# EAGLE design FMC_prototype (EAGLE 6.5.0)
DESIGNER: OPEN EPHYS; DESIGN_NAME: FMC ACQUISITION ADAPTER; REVISION: 0.1
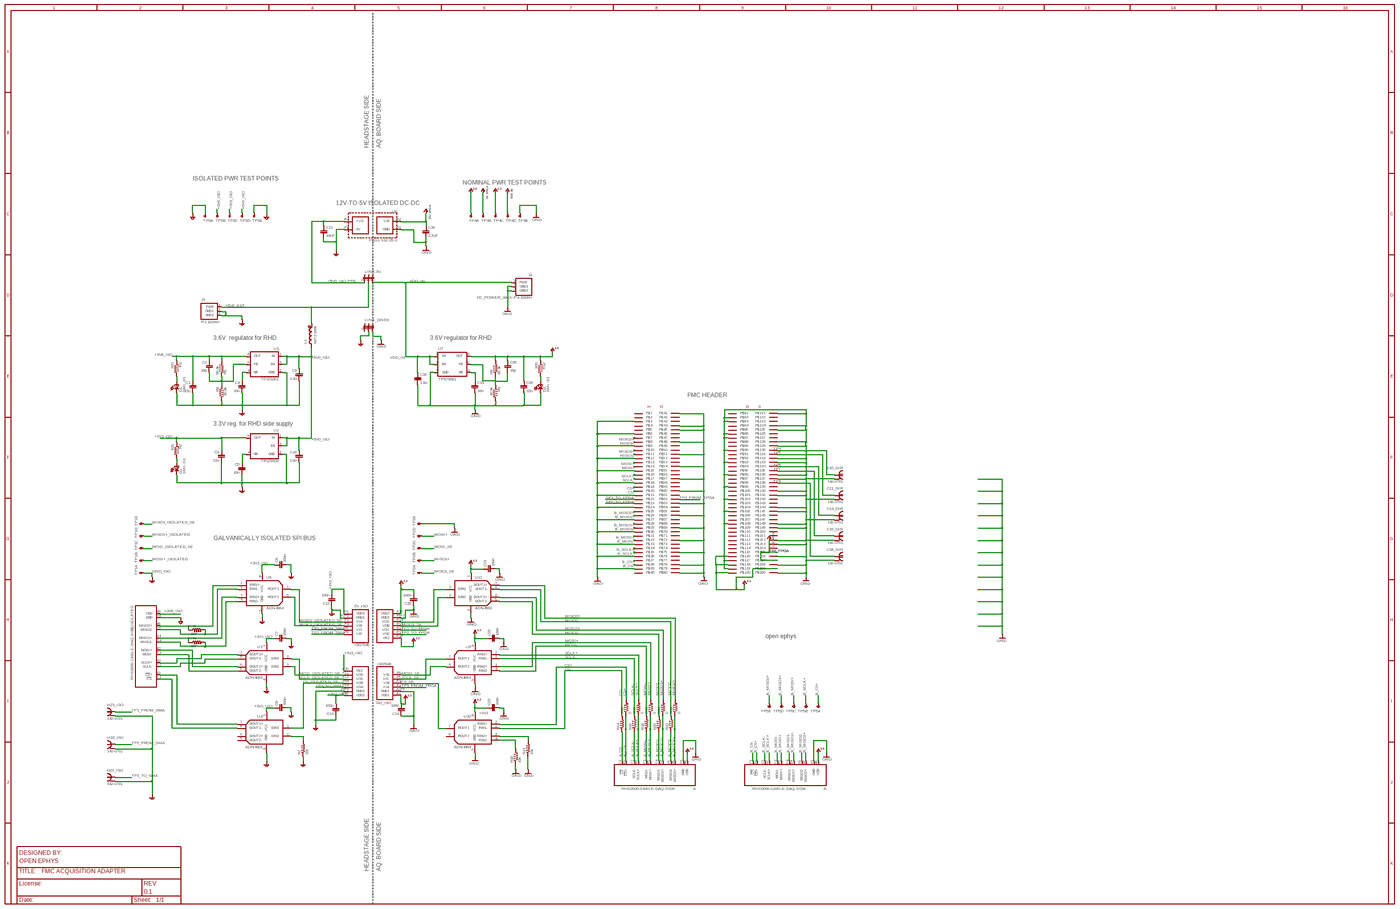
[diagram p0: schematic, sheet 1, overview]
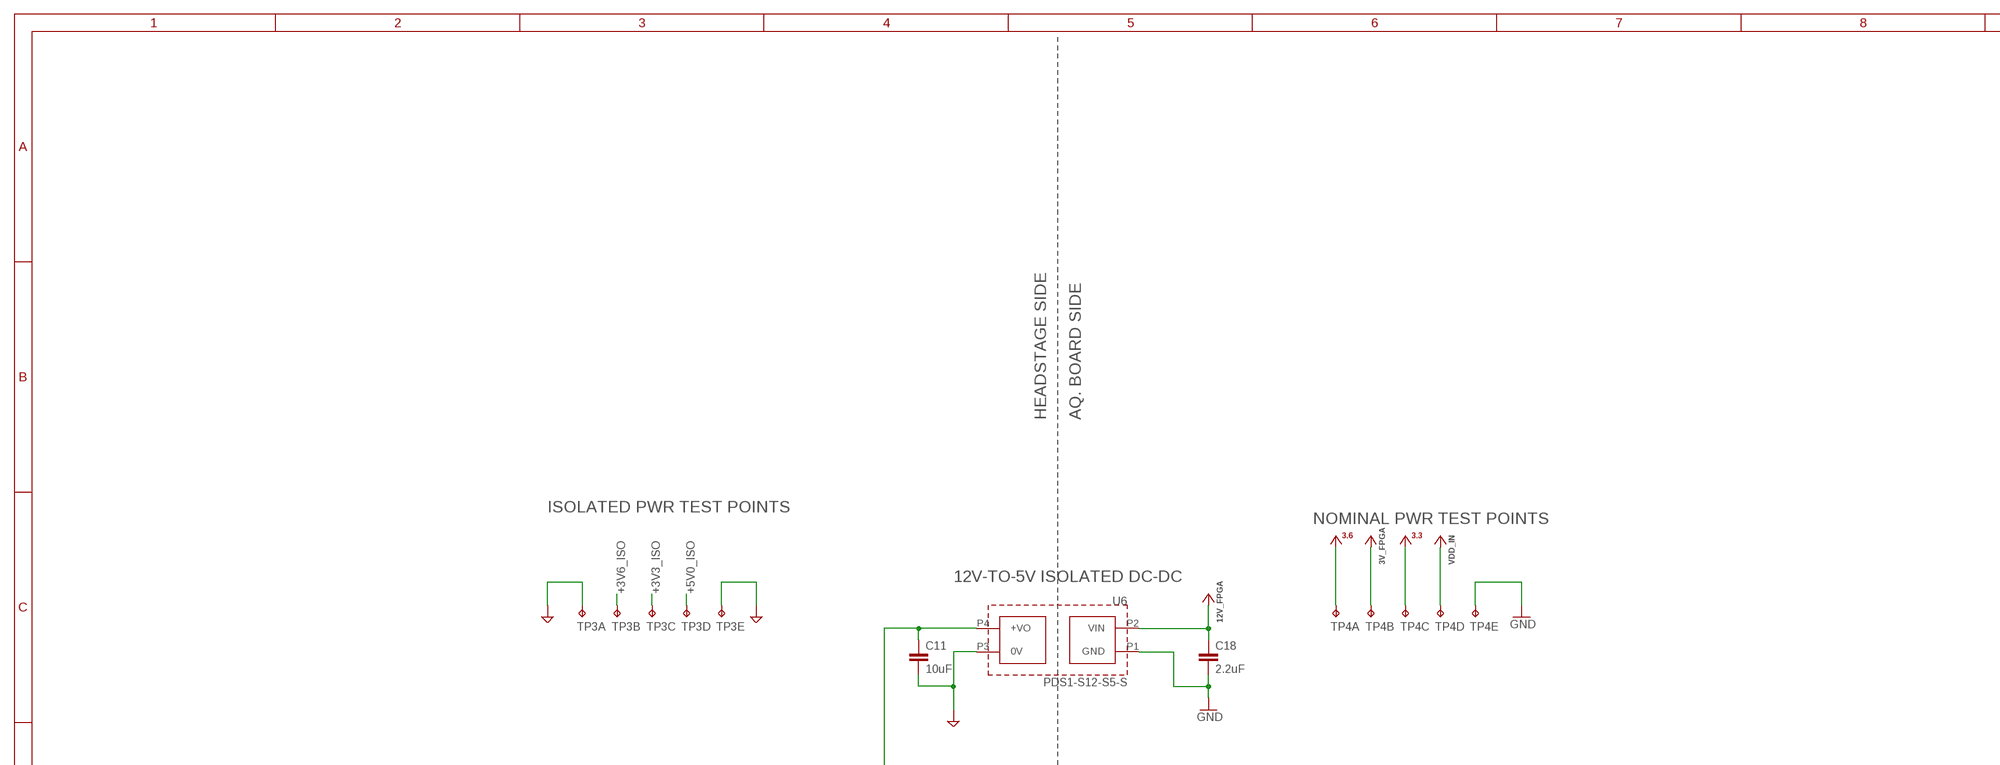
[diagram p1: schematic, sheet 1, part 1 of 4]
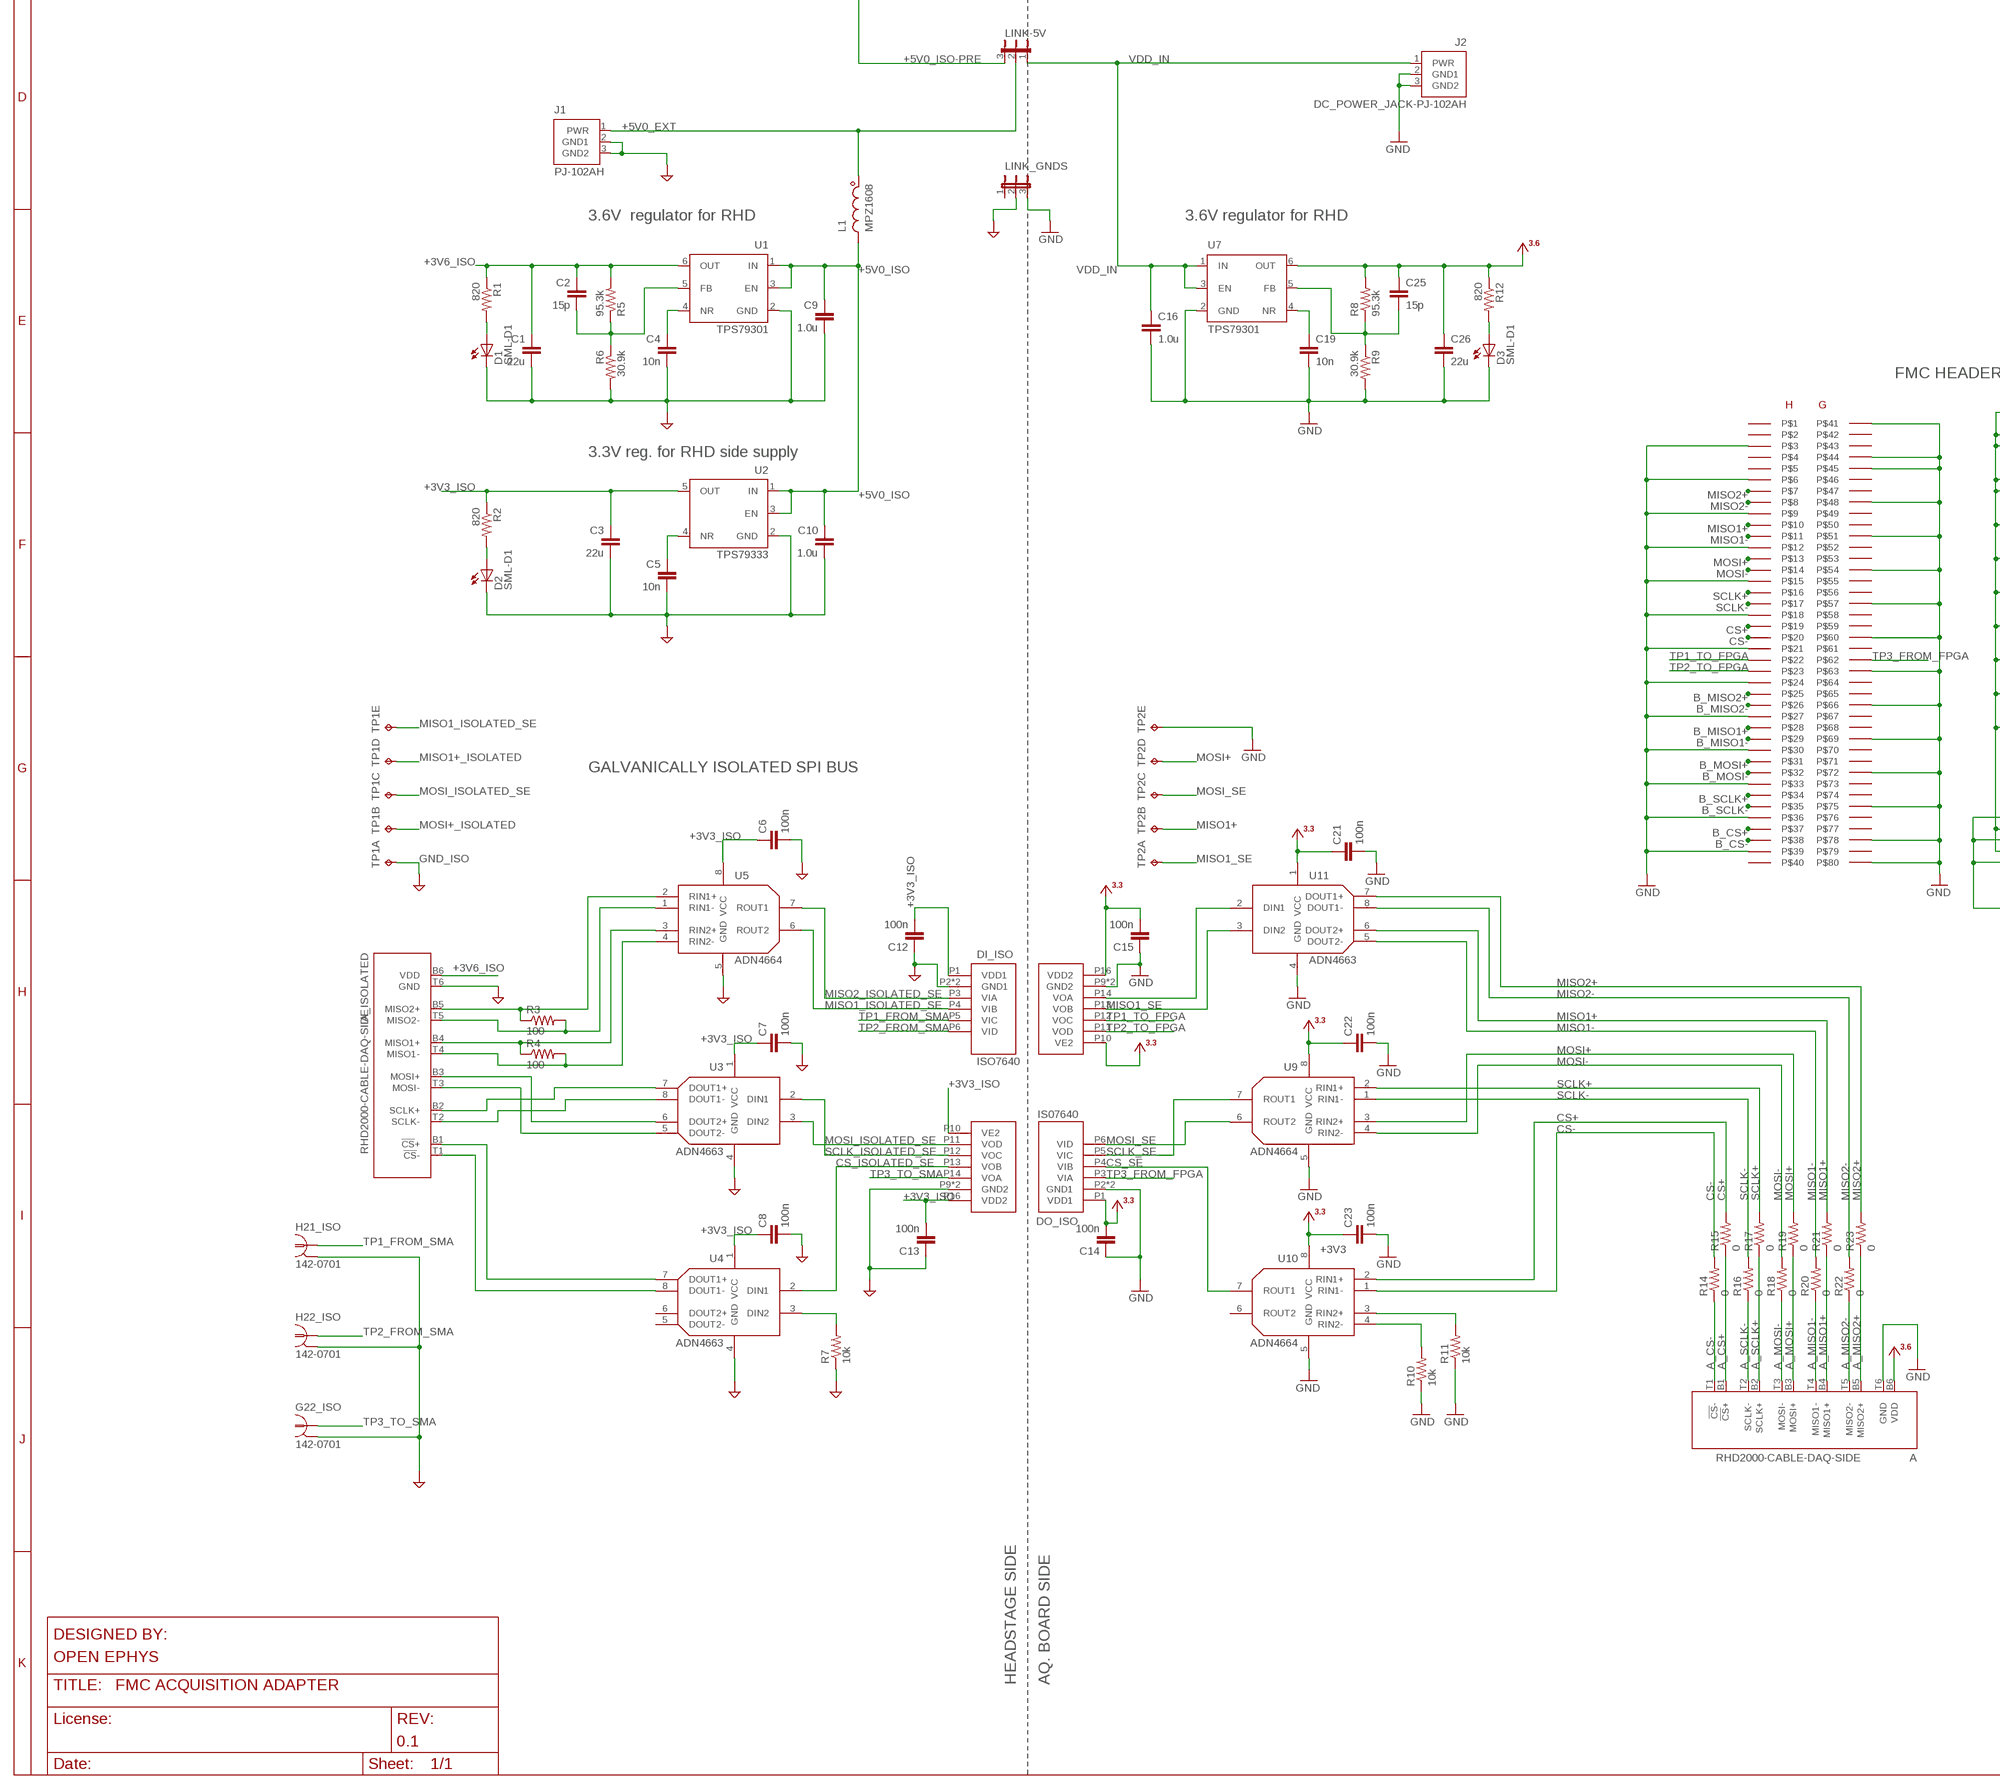
[diagram p2: schematic, sheet 1, part 2 of 4]
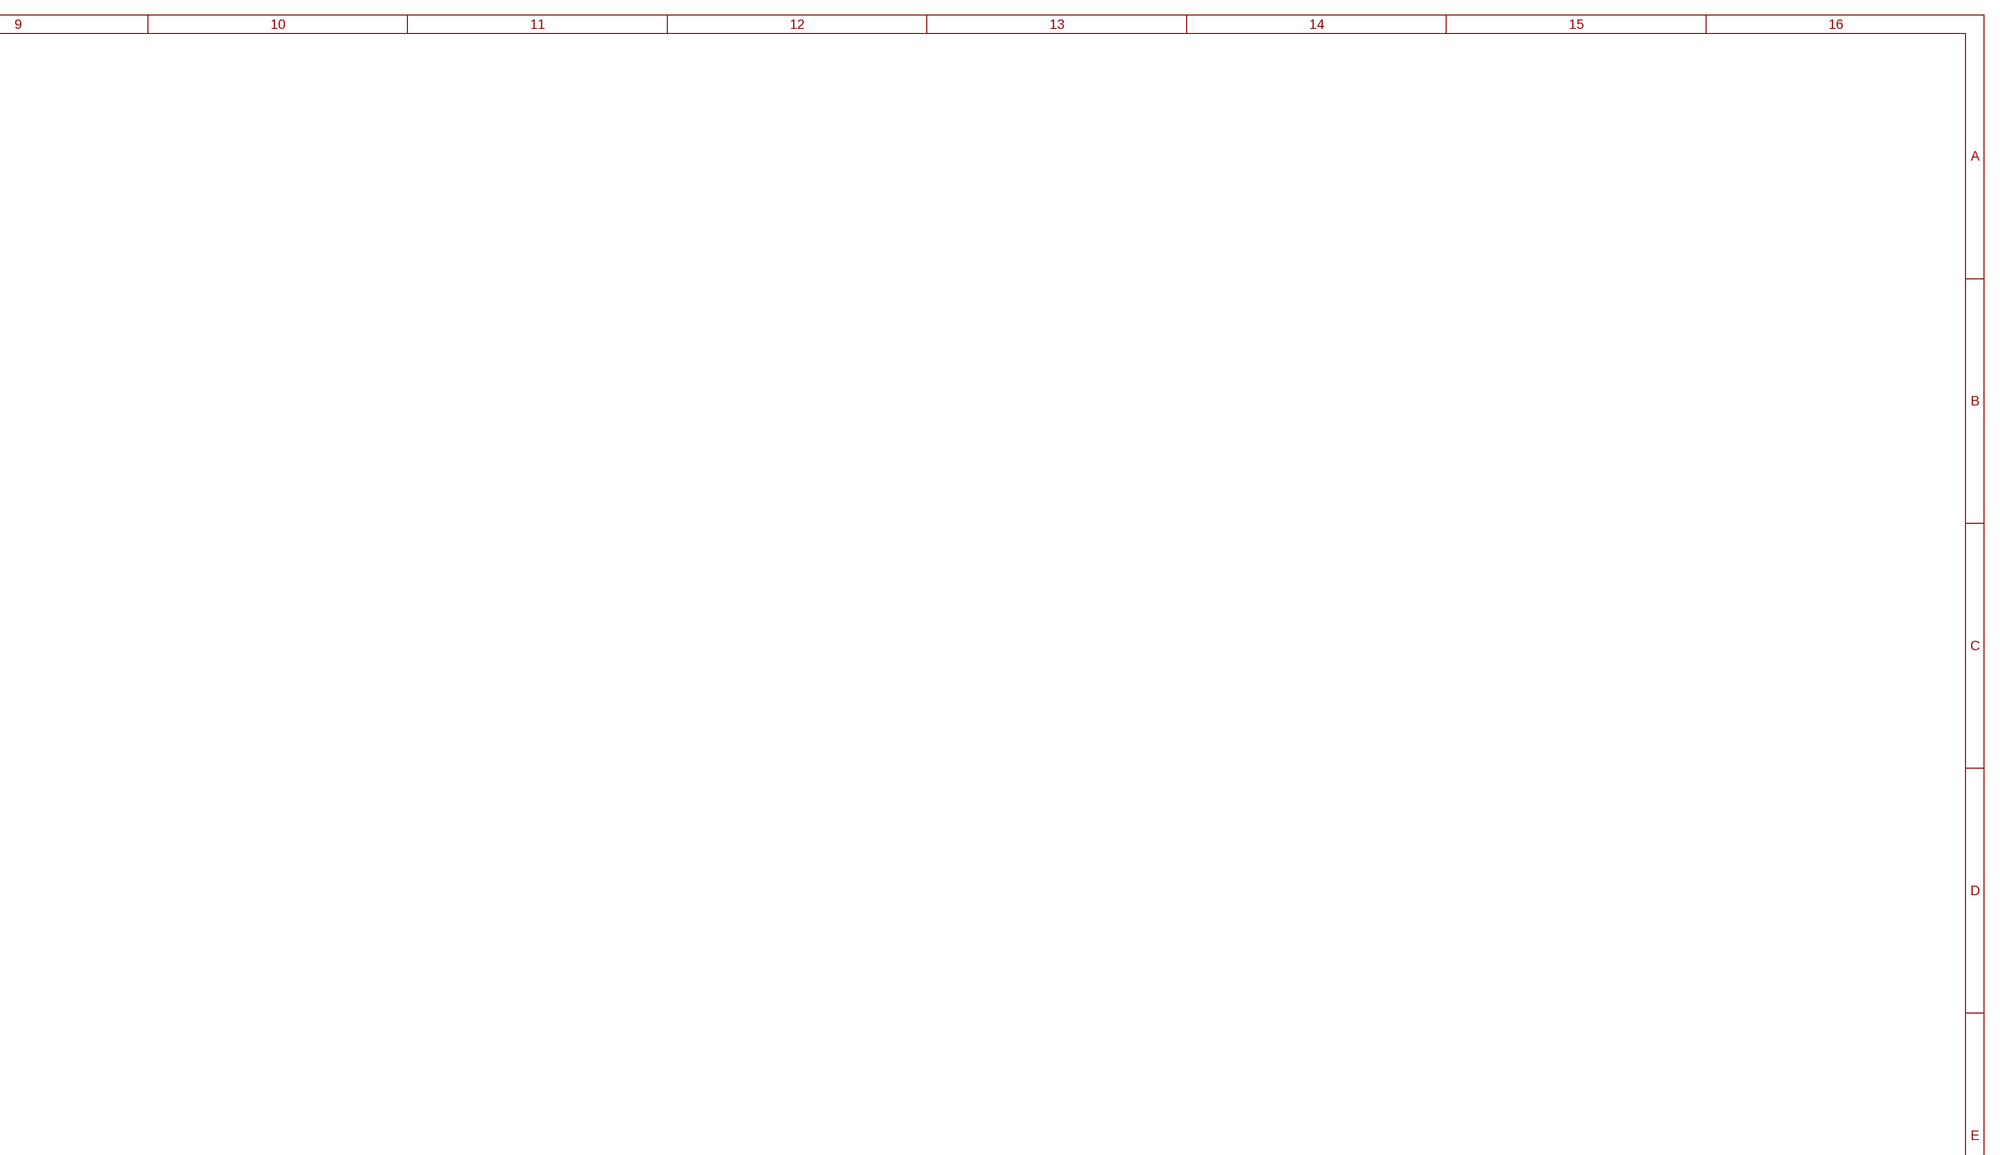
[diagram p3: schematic, sheet 1, part 3 of 4]
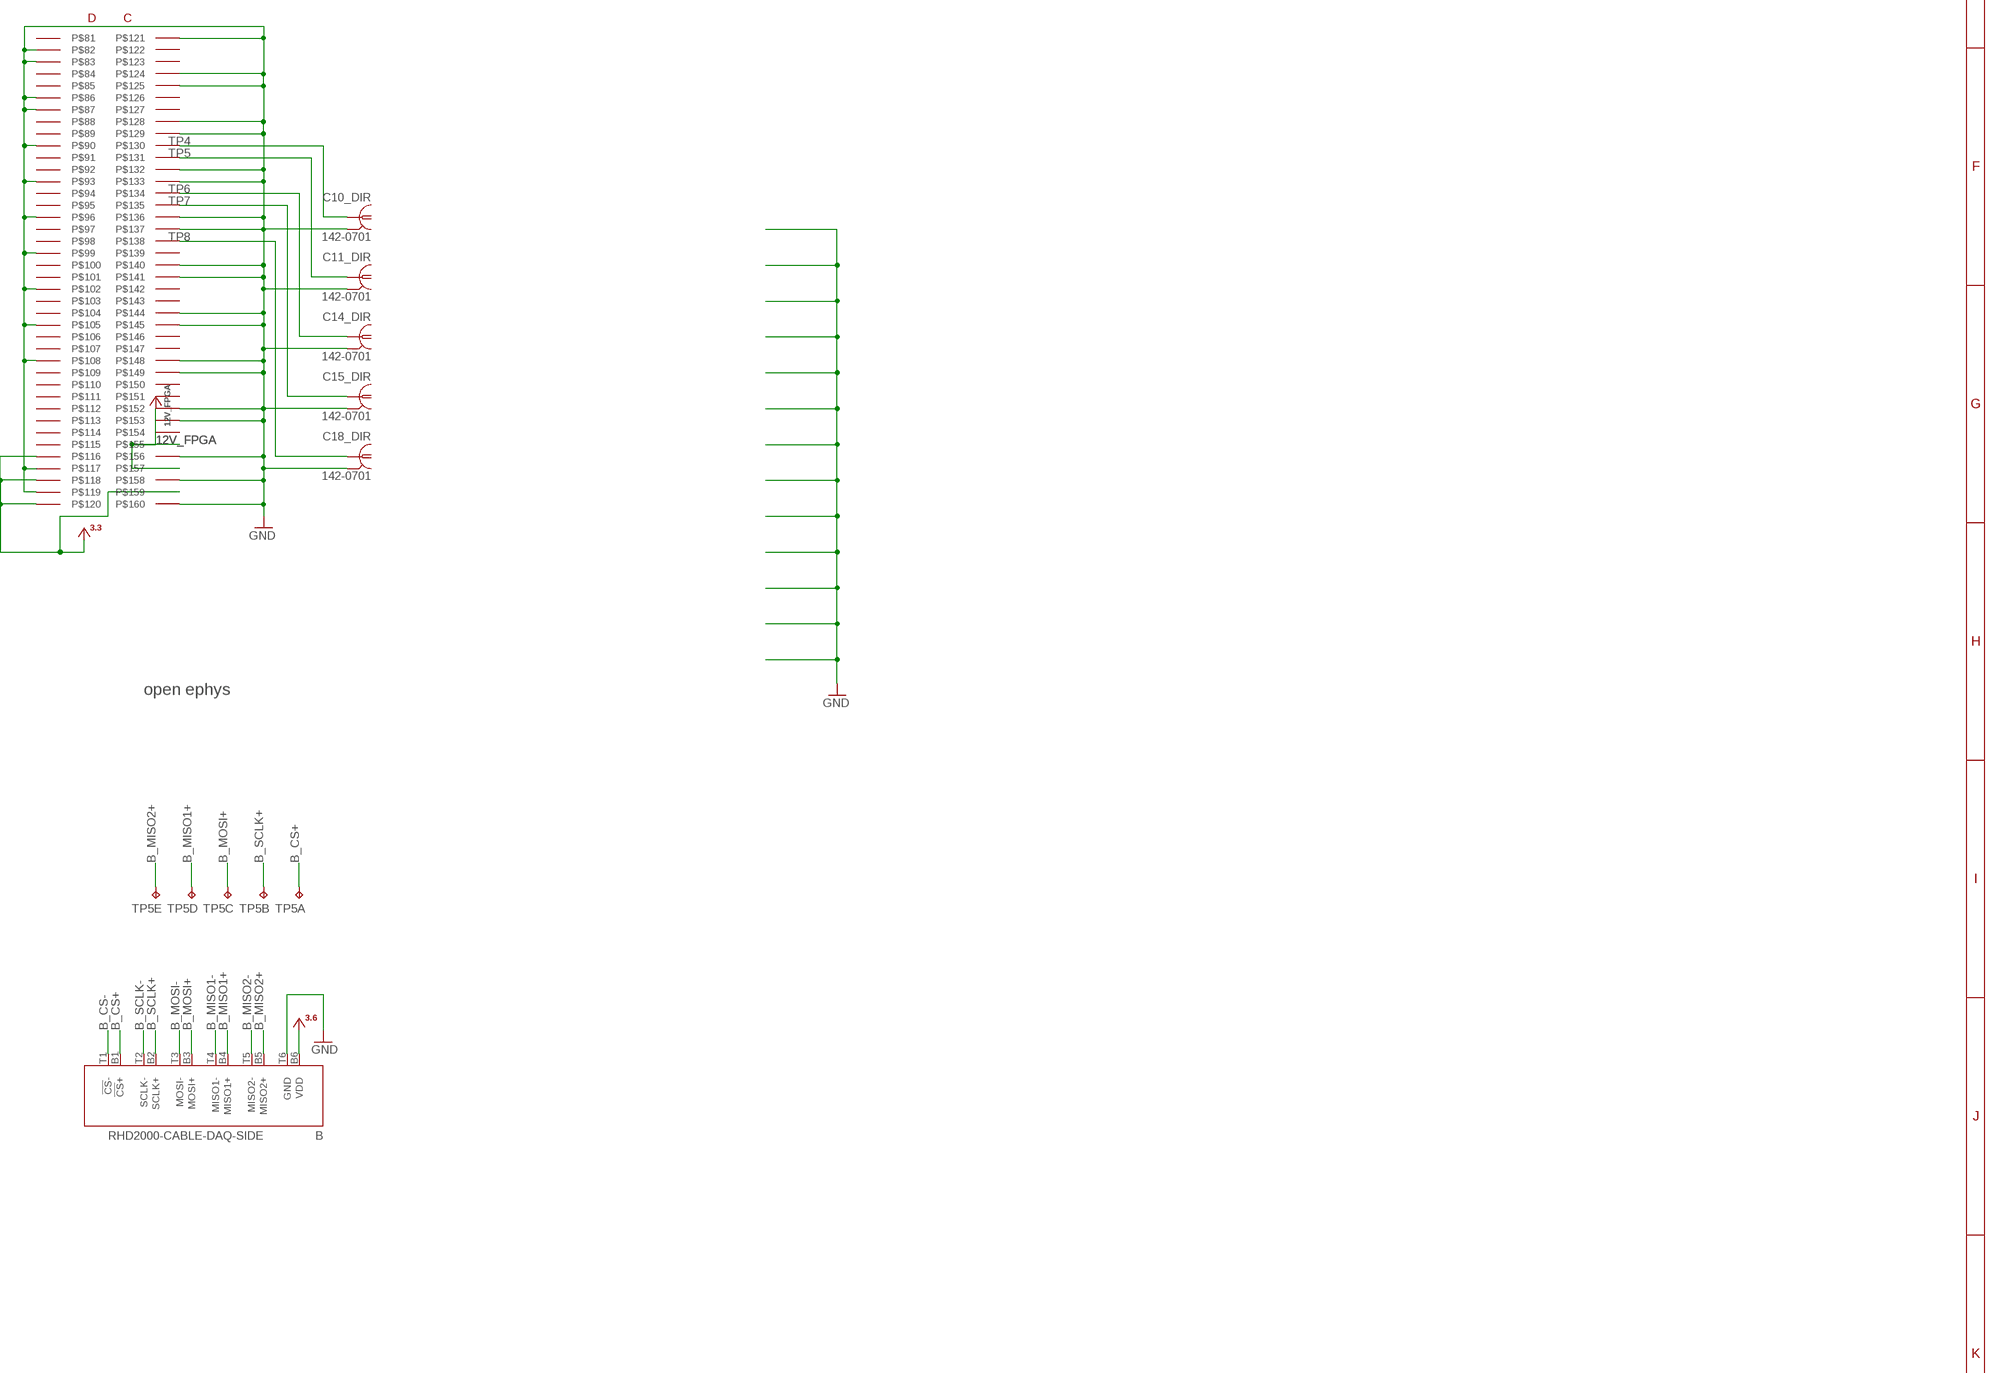
[diagram p4: schematic, sheet 1, part 4 of 4]

## Parts
A  RHD2000-CABLE-DAQ-SIDE  [OMNETICS_PZN-12-AA]
A_ISOLATED  RHD2000-CABLE-DAQ-SIDE  [OMNETICS_PZN-12-AA]
B  RHD2000-CABLE-DAQ-SIDE  [OMNETICS_PZN-12-AA]
C1  22u  C_1206  [1206]
C2  15p  C_0603  [0603]
C3  22u  C_1206  [1206]
C4  10n  C_0603  [0603]
C5  10n  C_0603  [0603]
C6  100n  C_0603  [0603]
C7  100n  C_0603  [0603]
C8  100n  C_0603  [0603]
C9  1.0u  C_0805  [0805]
C10  1.0u  C_0805  [0805]
C10_DIR  142-0701  COAX_SMA-VERT  [SMA_JACK_142-0701-201]
C11  10uF  C_1206  [1206]
C11_DIR  142-0701  COAX_SMA-VERT  [SMA_JACK_142-0701-201]
C12  100n  C_0603  [0603]
C13  100n  C_0603  [0603]
C14  100n  C_0603  [0603]
C14_DIR  142-0701  COAX_SMA-VERT  [SMA_JACK_142-0701-201]
C15  100n  C_0603  [0603]
C15_DIR  142-0701  COAX_SMA-VERT  [SMA_JACK_142-0701-201]
C16  1.0u  C_0805  [0805]
C18  2.2uF  C_1206  [1206]
C18_DIR  142-0701  COAX_SMA-VERT  [SMA_JACK_142-0701-201]
C19  10n  C_0603  [0603]
C21  100n  C_0603  [0603]
C22  100n  C_0603  [0603]
C23  100n  C_0603  [0603]
C25  15p  C_0603  [0603]
C26  22u  C_1206  [1206]
D1  SML-D1  LED_0603  [LED-0603]
D2  SML-D1  LED_0603  [LED-0603]
D3  SML-D1  LED_0603  [LED-0603]
DI_ISO  ISO7640  ADUM3440  [SOIC_WIDE_16]
DO_ISO  IS07640  ADUM3440  [SOIC_WIDE_16]
FMC  FMC_LPC_160_PIN  [FMC_LPC_MALE_WITH_SP601_BSILK]
G22_ISO  142-0701  COAX_SMA-VERT  [SMA_JACK_142-0701-201]
H21_ISO  142-0701  COAX_SMA-VERT  [SMA_JACK_142-0701-201]
H22_ISO  142-0701  COAX_SMA-VERT  [SMA_JACK_142-0701-201]
J1  PJ-102AH  DC_POWER_JACK-PJ-102AH  [PJ-102AH]
J2  DC_POWER_JACK-PJ-102AH  [PJ-102AH]
L1  MPZ1608  L_0603  [0603]
LINK-5V  JP2E  [JP2]
LINK_GNDS  JP2E  [JP2]
R1  820  R_0603  [0603]
R2  820  R_0603  [0603]
R3  100  R_0603  [0603]
R4  100  R_0603  [0603]
R5  95.3k  R_0603  [0603]
R6  30.9k  R_0603  [0603]
R7  10k  R_0603  [0603]
R8  95.3k  R_0603  [0603]
R9  30.9k  R_0603  [0603]
R10  10k  R_0603  [0603]
R11  10k  R_0603  [0603]
R12  820  R_0603  [0603]
R14  0  R_0603  [0603]
R15  0  R_0603  [0603]
R16  0  R_0603  [0603]
R17  0  R_0603  [0603]
R18  0  R_0603  [0603]
R19  0  R_0603  [0603]
R20  0  R_0603  [0603]
R21  0  R_0603  [0603]
R22  0  R_0603  [0603]
R23  0  R_0603  [0603]
TP1  TP5P5-25-13  [P5-25-13]
TP2  TP5P5-25-13  [P5-25-13]
TP3  TP5P5-25-13  [P5-25-13]
TP4  TP5P5-25-13  [P5-25-13]
TP5  TP5P5-25-13  [P5-25-13]
U1  TPS79301  [SOT-23-6]
U2  TPS79333  [SOT-23-5]
U3  ADN4663  ADN4663_SOIC  [SOIC127P500X400-8N]
U4  ADN4663  ADN4663_SOIC  [SOIC127P500X400-8N]
U5  ADN4664  ADN4664_SOIC  [SOIC127P500X400-8N]
U6  PDS1-S12-S5-S  PDS1  [PDS1]
U7  TPS79301  [SOT-23-6]
U9  ADN4664  ADN4664_SOIC  [SOIC127P500X400-8N]
U10  ADN4664  ADN4664_SOIC  [SOIC127P500X400-8N]
U11  ADN4663  ADN4663_SOIC  [SOIC127P500X400-8N]
U$1  OPEN_EPHYS_LOGO  [OPEN_EPHYS_LOGO]

## Nets
12V_FPGA: C18.1 FMC.P$155 FMC.P$157 U6.P2(VIN)
+3V3: C14.2 C15.2 C21.1 C22.1 C23.1 DI_ISO.P10(VE2) DI_ISO.P16(VDD2) DO_ISO.P1(VDD1) FMC.P$116 FMC.P$118 FMC.P$120 FMC.P$159 TP4.TP-2 TP4.TP-3 U9.8(VCC) U10.8(VCC) U11.1(VCC)
+3V3_ISO: C3.1 C6.1 C7.1 C8.1 C12.2 C13.2 DI_ISO.P1(VDD1) DO_ISO.P10(VE2) DO_ISO.P16(VDD2) R2.1 TP3.TP-3 U2.5(OUT) U3.1(VCC) U4.1(VCC) U5.8(VCC)
+3V6: A.B6(VDD) B.B6(VDD) C25.1 C26.1 R8.2 R12.1 TP4.TP-1 U7.6(OUT)
+3V6_ISO: A_ISOLATED.B6(VDD) C1.1 C2.1 R1.1 R5.2 TP3.TP-2 U1.6(OUT)
+5V0_EXT: J1.1(PWR) L1.1 LINK-5V.2
+5V0_ISO: C9.1 C10.1 L1.2 TP3.TP-4 U1.1(IN) U1.3(EN) U2.1(IN) U2.3(EN)
+5V0_ISO-PRE: C11.1 LINK-5V.3 U6.P4(+VO)
A_CS+: A.B1(!CS!+) R15.1
A_CS-: A.T1(!CS!-) R14.1
A_MISO1+: A.B4(MISO1+) R21.1
A_MISO1-: A.T4(MISO1-) R20.1
A_MISO2+: A.B5(MISO2+) R23.1
A_MISO2-: A.T5(MISO2-) R22.1
A_MOSI+: A.B3(MOSI+) R19.1
A_MOSI-: A.T3(MOSI-) R18.1
A_SCLK+: A.B2(SCLK+) R17.1
A_SCLK-: A.T2(SCLK-) R16.1
B_CS+: B.B1(!CS!+) FMC.P$37 TP5.TP-1
B_CS-: B.T1(!CS!-) FMC.P$38
B_MISO1+: B.B4(MISO1+) FMC.P$28 TP5.TP-4
B_MISO1-: B.T4(MISO1-) FMC.P$29
B_MISO2+: B.B5(MISO2+) FMC.P$25 TP5.TP-5
B_MISO2-: B.T5(MISO2-) FMC.P$26
B_MOSI+: B.B3(MOSI+) FMC.P$31 TP5.TP-3
B_MOSI-: B.T3(MOSI-) FMC.P$32
B_SCLK+: B.B2(SCLK+) FMC.P$34 TP5.TP-2
B_SCLK-: B.T2(SCLK-) FMC.P$35
CS+: FMC.P$19 R15.2 U10.2(RIN1+)
CS+_ISOLATED: A_ISOLATED.B1(!CS!+) U4.7(DOUT1+)
CS-: FMC.P$20 R14.2 U10.1(RIN1-)
CS-_ISOLATED: A_ISOLATED.T1(!CS!-) U4.8(DOUT1-)
CS_ISOLATED_SE: DO_ISO.P13(VOB) U4.2(DIN1)
CS_SE: DO_ISO.P4(VIB) U10.7(ROUT1)
GND: A.T6(GND) B.T6(GND) C10_DIR.GND$1 C10_DIR.GND$2 C10_DIR.GND$3 C10_DIR.GND$4 C11_DIR.GND$1 C11_DIR.GND$2 C11_DIR.GND$3 C11_DIR.GND$4 C14.1 C14_DIR.GND$1 C14_DIR.GND$2 C14_DIR.GND$3 C14_DIR.GND$4 C15.1 C15_DIR.GND$1 C15_DIR.GND$2 C15_DIR.GND$3 C15_DIR.GND$4 C16.2 C18.2 C18_DIR.GND$1 C18_DIR.GND$2 C18_DIR.GND$3 C18_DIR.GND$4 C19.2 C21.2 C22.2 C23.2 C26.2 D3.C DI_ISO.P9(GND2) DI_ISO.P15(GND2) DO_ISO.P2(GND1) DO_ISO.P8(GND1) FMC.P$3 FMC.P$6 FMC.P$9 FMC.P$12 FMC.P$15 FMC.P$18 FMC.P$21 FMC.P$24 FMC.P$27 FMC.P$30 FMC.P$33 FMC.P$36 FMC.P$39 FMC.P$41 FMC.P$44 FMC.P$45 FMC.P$48 FMC.P$51 FMC.P$54 FMC.P$57 FMC.P$60 FMC.P$63 FMC.P$66 FMC.P$69 FMC.P$72 FMC.P$75 FMC.P$78 FMC.P$80 FMC.P$82 FMC.P$83 FMC.P$86 FMC.P$87 FMC.P$90 FMC.P$93 FMC.P$96 FMC.P$99 FMC.P$102 FMC.P$105 FMC.P$108 FMC.P$117 FMC.P$119 FMC.P$121 FMC.P$124 FMC.P$125 FMC.P$128 FMC.P$129 FMC.P$132 FMC.P$133 FMC.P$136 FMC.P$137 FMC.P$140 FMC.P$141 FMC.P$144 FMC.P$145 FMC.P$148 FMC.P$149 FMC.P$152 FMC.P$153 FMC.P$156 FMC.P$158 FMC.P$160 J2.2(GND1) J2.3(GND2) LINK_GNDS.3 R9.2 R10.1 R11.1 TP2.TP-5 TP4.TP-5 U6.P1(GND) U7.2(GND) U9.5(GND) U10.5(GND) U11.4(GND)
GND_ISO: A_ISOLATED.T6(GND) C1.2 C3.2 C4.2 C5.2 C6.2 C7.2 C8.2 C9.2 C10.2 C11.2 C12.1 C13.1 D1.C D2.C DI_ISO.P2(GND1) DI_ISO.P8(GND1) DO_ISO.P9(GND2) DO_ISO.P15(GND2) G22_ISO.GND$1 G22_ISO.GND$2 G22_ISO.GND$3 G22_ISO.GND$4 H21_ISO.GND$1 H21_ISO.GND$2 H21_ISO.GND$3 H21_ISO.GND$4 H22_ISO.GND$1 H22_ISO.GND$2 H22_ISO.GND$3 H22_ISO.GND$4 J1.2(GND1) J1.3(GND2) LINK_GNDS.2 R6.2 R7.1 TP1.TP-1 TP3.TP-1 TP3.TP-5 U1.2(GND) U2.2(GND) U3.4(GND) U4.4(GND) U5.5(GND) U6.P3(0V)
MISO1+: FMC.P$10 R21.2 TP2.TP-2 U11.6(DOUT2+)
MISO1+_ISOLATED: A_ISOLATED.B4(MISO1+) R4.1 TP1.TP-4 U5.3(RIN2+)
MISO1-: FMC.P$11 R20.2 U11.5(DOUT2-)
MISO1-_ISOLATED: A_ISOLATED.T4(MISO1-) R4.2 U5.4(RIN2-)
MISO1_ISOLATED_SE: DI_ISO.P4(VIB) TP1.TP-5 U5.6(ROUT2)
MISO1_SE: DI_ISO.P13(VOB) TP2.TP-1 U11.3(DIN2)
MISO2+: FMC.P$7 R23.2 U11.7(DOUT1+)
MISO2+_ISOLATED: A_ISOLATED.B5(MISO2+) R3.1 U5.2(RIN1+)
MISO2-: FMC.P$8 R22.2 U11.8(DOUT1-)
MISO2-_ISOLATED: A_ISOLATED.T5(MISO2-) R3.2 U5.1(RIN1-)
MISO2_ISOLATED_SE: DI_ISO.P3(VIA) U5.7(ROUT1)
MISO2_SE: DI_ISO.P14(VOA) U11.2(DIN1)
MOSI+: FMC.P$13 R19.2 TP2.TP-4 U9.3(RIN2+)
MOSI+_ISOLATED: A_ISOLATED.B3(MOSI+) TP1.TP-2 U3.6(DOUT2+)
MOSI-: FMC.P$14 R18.2 U9.4(RIN2-)
MOSI-_ISOLATED: A_ISOLATED.T3(MOSI-) U3.5(DOUT2-)
MOSI_ISOLATED_SE: DO_ISO.P11(VOD) TP1.TP-3 U3.3(DIN2)
MOSI_SE: DO_ISO.P6(VID) TP2.TP-3 U9.6(ROUT2)
N$1: R11.2 U10.3(RIN2+)
N$3: R10.2 U10.4(RIN2-)
N$4: D3.A R12.2
N$5: R7.2 U4.3(DIN2)
N$10: D2.A R2.2
N$11: D1.A R1.2
N$14: C19.1 U7.4(NR)
N$27: C25.2 R8.1 R9.1 U7.5(FB)
N$36: C4.1 U1.4(NR)
N$37: C2.2 R5.1 R6.1 U1.5(FB)
N$97: C5.1 U2.4(NR)
SCLK+: FMC.P$16 R17.2 U9.2(RIN1+)
SCLK+_ISOLATED: A_ISOLATED.B2(SCLK+) U3.7(DOUT1+)
SCLK-: FMC.P$17 R16.2 U9.1(RIN1-)
SCLK-_ISOLATED: A_ISOLATED.T2(SCLK-) U3.8(DOUT1-)
SCLK_ISOLATED_SE: DO_ISO.P12(VOC) U3.2(DIN1)
SCLK_SE: DO_ISO.P5(VIC) U9.7(ROUT1)
TP1_FROM_SMA: DI_ISO.P5(VIC) H21_ISO.CLK
TP1_TO_FPGA: DI_ISO.P12(VOC) FMC.P$22
TP2_FROM_SMA: DI_ISO.P6(VID) H22_ISO.CLK
TP2_TO_FPGA: DI_ISO.P11(VOD) FMC.P$23
TP3_FROM_FPGA: DO_ISO.P3(VIA) FMC.P$62
TP3_TO_SMA: DO_ISO.P14(VOA) G22_ISO.CLK
TP4: C10_DIR.CLK FMC.P$130
TP5: C11_DIR.CLK FMC.P$131
TP6: C14_DIR.CLK FMC.P$134
TP7: C15_DIR.CLK FMC.P$135
TP8: C18_DIR.CLK FMC.P$138
VDD_IN: C16.1 J2.1(PWR) LINK-5V.1 TP4.TP-4 U7.1(IN) U7.3(EN)
Unconnected: FMC.P$1 FMC.P$2 FMC.P$4 FMC.P$5 FMC.P$40 FMC.P$42 FMC.P$43 FMC.P$46 FMC.P$47 FMC.P$49 FMC.P$50 FMC.P$52 FMC.P$53 FMC.P$55 FMC.P$56 FMC.P$58 FMC.P$59 FMC.P$61 FMC.P$64 FMC.P$65 FMC.P$67 FMC.P$68 FMC.P$70 FMC.P$71 FMC.P$73 FMC.P$74 FMC.P$76 FMC.P$77 FMC.P$79 FMC.P$81 FMC.P$84 FMC.P$85 FMC.P$88 FMC.P$89 FMC.P$91 FMC.P$92 FMC.P$94 FMC.P$95 FMC.P$97 FMC.P$98 FMC.P$100 FMC.P$101 FMC.P$103 FMC.P$104 FMC.P$106 FMC.P$107 FMC.P$109 FMC.P$110 FMC.P$111 FMC.P$112 FMC.P$113 FMC.P$114 FMC.P$115 FMC.P$122 FMC.P$123 FMC.P$126 FMC.P$127 FMC.P$139 FMC.P$142 FMC.P$143 FMC.P$146 FMC.P$147 FMC.P$150 FMC.P$151 FMC.P$154 LINK_GNDS.1 U4.5(DOUT2-) U4.6(DOUT2+) U10.6(ROUT2)

## Notes on the sheet
- HEADSTAGE SIDE | AQ. BOARD SIDE
- ISOLATED PWR TEST POINTS
- NOMINAL PWR TEST POINTS
- 12V-TO-5V ISOLATED DC-DC
- 3.6V  regulator for RHD | 3.6V regulator for RHD
- FMC HEADER
- 3.3V reg. for RHD side supply
- GALVANICALLY ISOLATED SPI BUS
- HEADSTAGE SIDE | AQ. BOARD SIDE

## Power pins joined to a net without a drawn wire
GND: FMC.GNDA(GND$1:GND) FMC.GNDB(GND$2:GND)

## Library data of the parts
A A_ISOLATED B = RHD2000_eval_board:RHD2000-CABLE-DAQ-SIDE: Omnetics PZN-12-AA RHD2000 socket - DAQ side
C1-C10 C12-C16 C19 C21-C23 C25 C26 = RHD2000_eval_board:C: Capacitor
C10_DIR C11_DIR C14_DIR C15_DIR C18_DIR G22_ISO H21_ISO H22_ISO = jonnew:COAX: COAX CONNECTOR - Edge mount BNC - Vertical BNC - Vertical SMA - etc
C11 C18 = jonnew:C: Capacitor
D1-D3 = jonnew:LED: Surface mount LED
DI_ISO DO_ISO = jonnew:ADUM3440
FMC = jonnew:FMC_LPC_160_PIN
J1 J2 = RHD2000_eval_board:DC_POWER_JACK: DC Power Jack
L1 = jonnew:L: Inductor
LINK-5V LINK_GNDS = jumper:JP2E: JUMPER
R1-R12 R14-R23 = RHD2000_eval_board:R: Resistor
TP1-TP5 = testpad:TP5: Test pad
U1 U7 = RHD2000_eval_board:TPS79301: Texas Instruments TPS79301 adjustable regulator
U2 = jonnew:TPS79333: Texas Instruments TPS79333 3.3V LDO regulator
U3 U4 U11 = jonnew:ADN4663: Dual 3V3 CMOS to LVDS differential line driver
U5 U9 U10 = jonnew:ADN4664: Dual LVLDS to 3V3 CMOS differential line receiver
U6 = jonnew:PDS1: CUI inc. DC-DC converter, see http://www.cui.com/product/resource/pds1-s.pdf
U$1 = open-ephys:OPEN_EPHYS_LOGO: Open Ephys logo

## Board
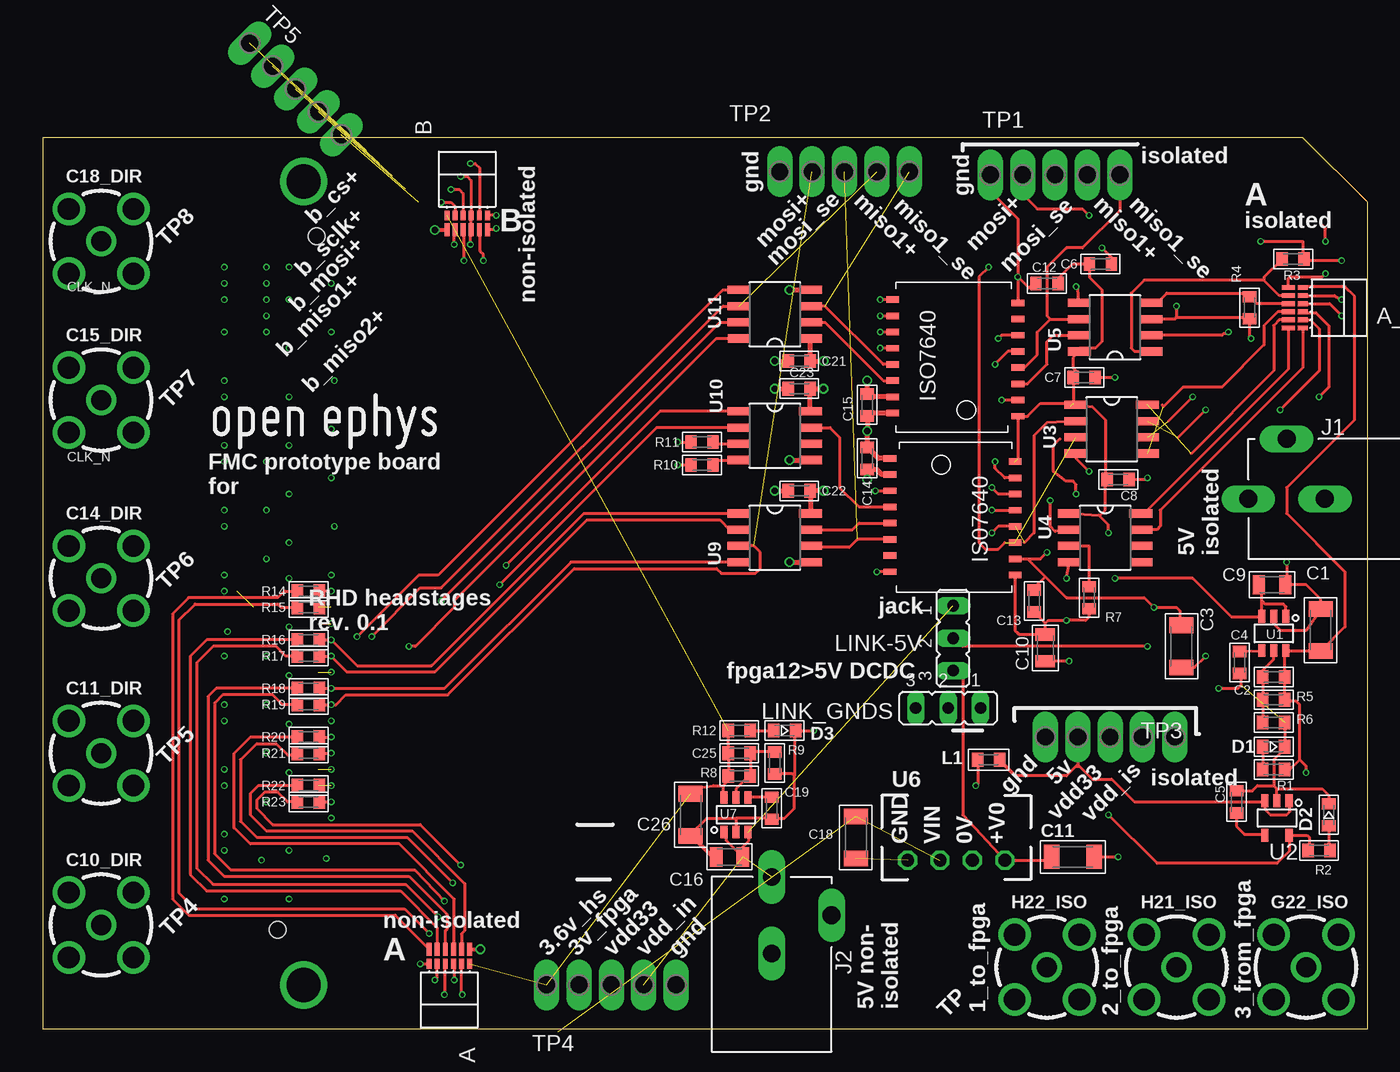
[diagram p5: board, top side]
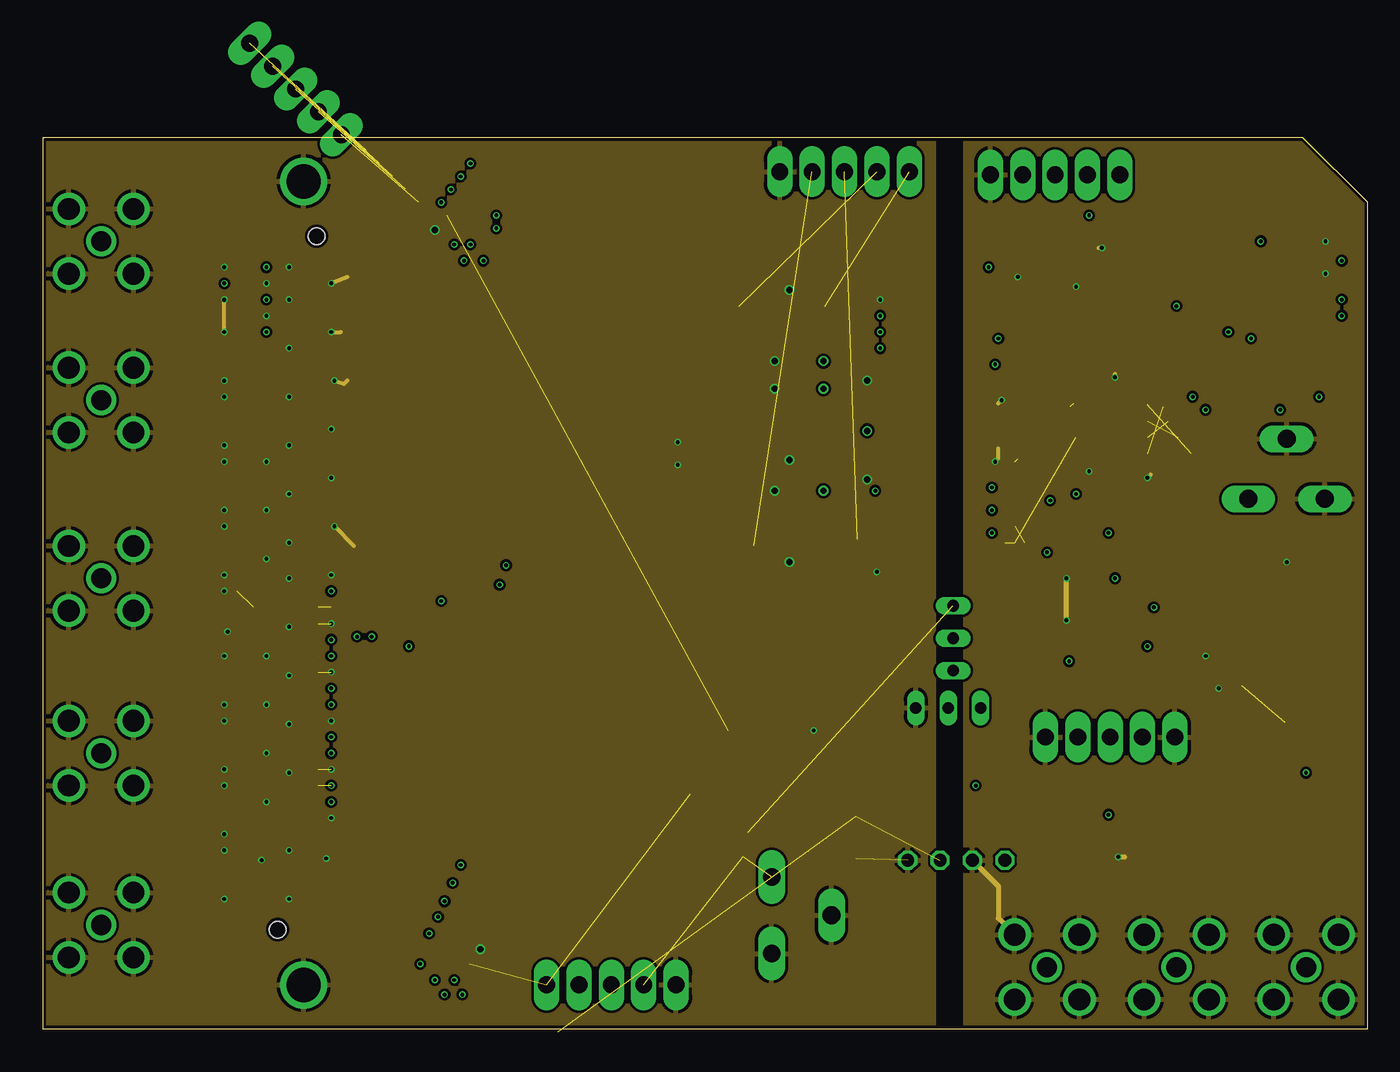
[diagram p6: board, inner layer $GND]
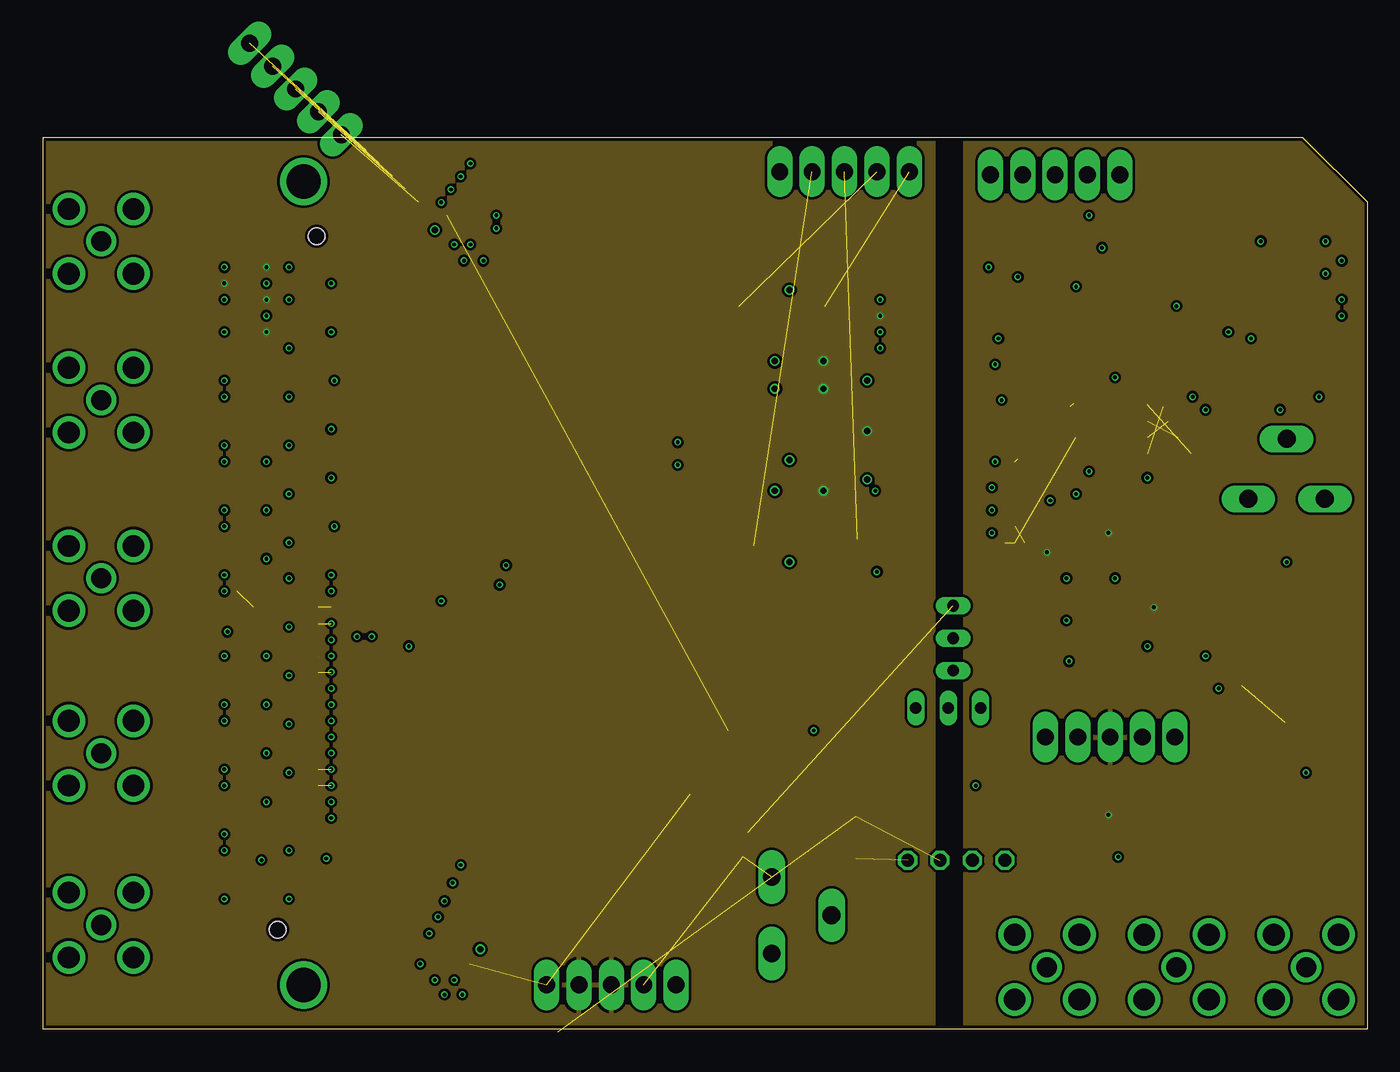
[diagram p7: board, inner layer $VCC]
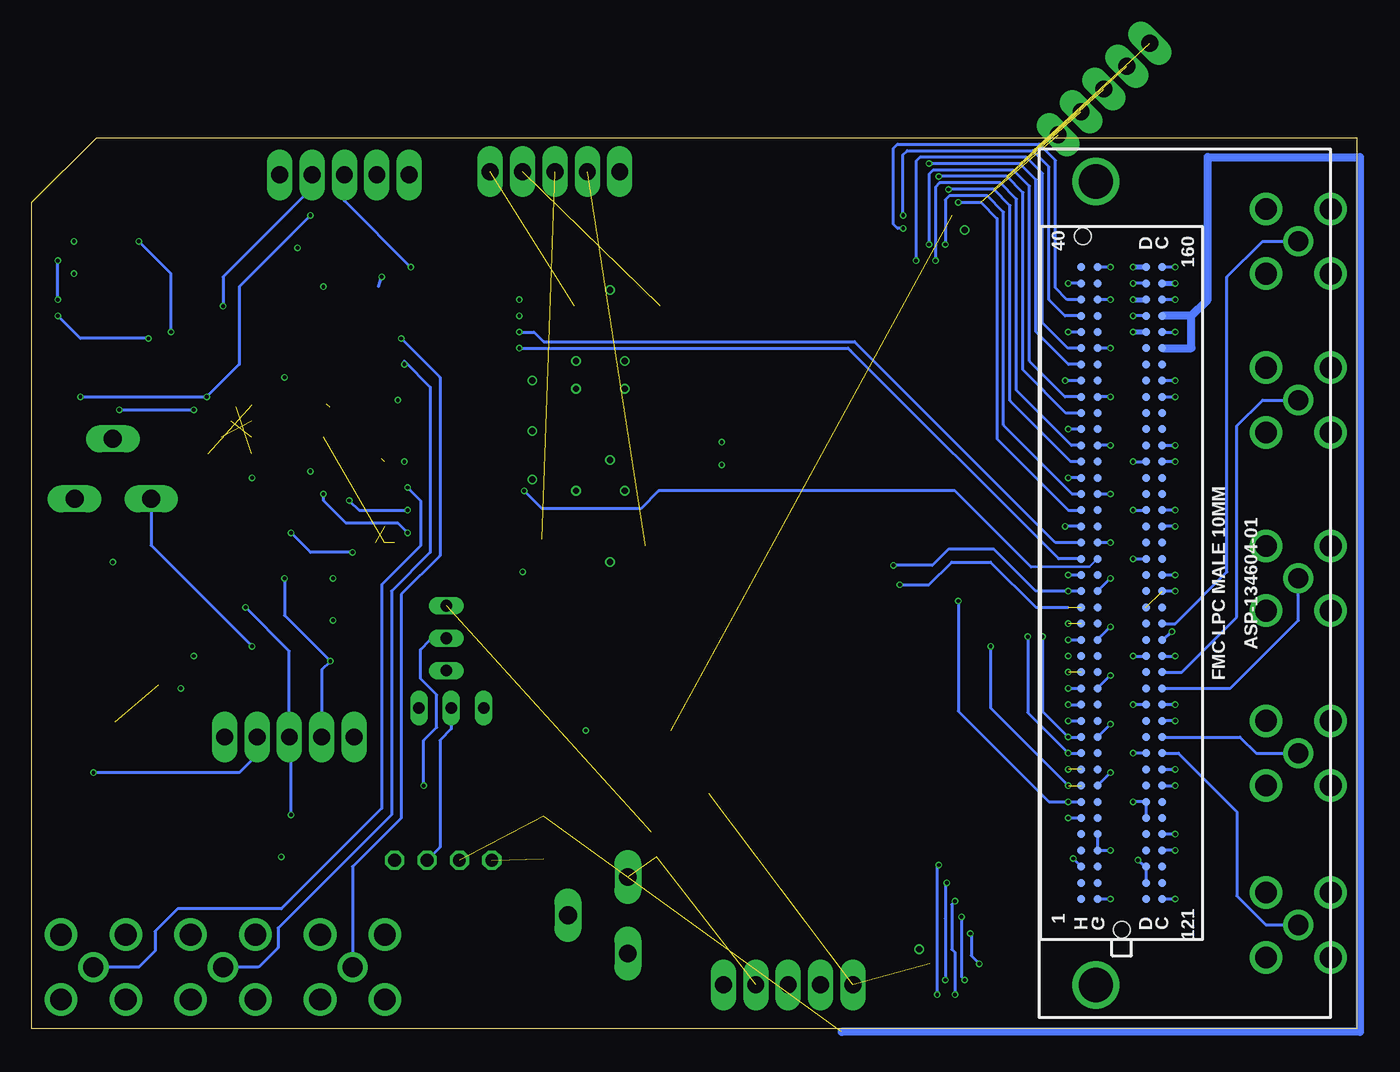
[diagram p8: board, bottom side, seen from below]

Size 103.89 x 69.85 mm. Coordinates in mm from the lower left corner, seen from the top.
Outline: 0,0 103.89,0 103.89,64.77 98.81,69.85 0,69.84 0,0
Copper layers (1*2*15*16): Top 0.035mm / dielectric 0.2mm / $GND 0.0175mm / dielectric 0.3mm / $VCC 0.0175mm / dielectric 0.2mm / Bottom 0.035mm
Design rules "seeed-studio-4-layer": minimum track width 8mil, minimum drill 12mil, track to track 8mil, track to pad 8mil, pad to pad 8mil, via to via 8mil, smd to smd 0mil, copper to edge 10mil, drill to drill 8mil, minimum pad ring 6mil, minimum via ring 4mil, stop-mask expansion 4mil, vias tented up to drill 100mil, thermal gap 10mil

### Footprints (pad centres in the part's own frame; a part is rotated, then mirrored left to right if it is on the bottom)
OMNETICS_PZN-12-AA = smd 0.381 x 0.762: B1 1.587,-1.016; B2 0.953,-1.016; B3 0.318,-1.016; B4 -0.318,-1.016; B5 -0.953,-1.016; B6 -1.587,-1.016 | smd 0.381 x 1.016: T1 1.587,-2.159; T2 0.953,-2.159; T3 0.318,-2.159; T4 -0.318,-2.159; T5 -0.953,-2.159; T6 -1.587,-2.159
1206 = smd 1.219 x 1.88: 1 -1.651,0; 2 1.651,0
0603 = smd 0.889 x 1.067: 1 -0.864,0; 2 0.864,0
0805 = smd 0.965 x 1.524: 1 -1.041,0; 2 1.041,0
SMA_JACK_142-0701-201 = drill 1.575: CLK 0,0 | drill 1.702: GND$1 -2.54,2.54; GND$2 2.54,2.54; GND$3 -2.54,-2.54; GND$4 2.54,-2.54
LED-0603 = smd 1.067 x 0.889: A 0,-0.864; C 0,0.864
SOIC_WIDE_16 = smd 0.5 x 1: P1 -4.064,-4.064; P2 -2.794,-4.064; P3 -1.524,-4.064; P4 -0.254,-4.064; P5 1.016,-4.064; P6 2.286,-4.064; P7 3.556,-4.064; P8 4.826,-4.064; P9 5.08,5.75; P10 3.81,5.75; P11 2.54,5.75; P12 1.27,5.75; P13 0,5.75; P14 -1.27,5.75; P15 -2.54,5.75; P16 -3.81,5.75
FMC_LPC_MALE_WITH_SP601_BSILK = drill 2.692: GNDA -31.496,2.032; GNDB 31.496,2.032 | smd 0.635 x 0.635 bottom: P$1 24.765,3.175; P$2 23.495,3.175; P$3 22.225,3.175; P$4 20.955,3.175; P$5 19.685,3.175; P$6 18.415,3.175; P$7 17.145,3.175; P$8 15.875,3.175; P$9 14.605,3.175; P$10 13.335,3.175; P$11 12.065,3.175; P$12 10.795,3.175; P$13 9.525,3.175; P$14 8.255,3.175; P$15 6.985,3.175; P$16 5.715,3.175; P$17 4.445,3.175; P$18 3.175,3.175; P$19 1.905,3.175; P$20 0.635,3.175; P$21 -0.635,3.175; P$22 -1.905,3.175; P$23 -3.175,3.175; P$24 -4.445,3.175; P$25 -5.715,3.175; P$26 -6.985,3.175; P$27 -8.255,3.175; P$28 -9.525,3.175; P$29 -10.795,3.175; P$30 -12.065,3.175; P$31 -13.335,3.175; P$32 -14.605,3.175; P$33 -15.875,3.175; P$34 -17.145,3.175; P$35 -18.415,3.175; P$36 -19.685,3.175; P$37 -20.955,3.175; P$38 -22.225,3.175; P$39 -23.495,3.175; P$40 -24.765,3.175; P$41 24.765,1.905; P$42 23.495,1.905; P$43 22.225,1.905; P$44 20.955,1.905; P$45 19.685,1.905; P$46 18.415,1.905; P$47 17.145,1.905; P$48 15.875,1.905; P$49 14.605,1.905; P$50 13.335,1.905; P$51 12.065,1.905; P$52 10.795,1.905; P$53 9.525,1.905; P$54 8.255,1.905; P$55 6.985,1.905; P$56 5.715,1.905; P$57 4.445,1.905; P$58 3.175,1.905; P$59 1.905,1.905; P$60 0.635,1.905; P$61 -0.635,1.905; P$62 -1.905,1.905; P$63 -3.175,1.905; P$64 -4.445,1.905; P$65 -5.715,1.905; P$66 -6.985,1.905; P$67 -8.255,1.905; P$68 -9.525,1.905; P$69 -10.795,1.905; P$70 -12.065,1.905; P$71 -13.335,1.905; P$72 -14.605,1.905; P$73 -15.875,1.905; P$74 -17.145,1.905; P$75 -18.415,1.905; P$76 -19.685,1.905; P$77 -20.955,1.905; P$78 -22.225,1.905; P$79 -23.495,1.905; P$80 -24.765,1.905; P$81 24.765,-1.905; P$82 23.495,-1.905; P$83 22.225,-1.905; P$84 20.955,-1.905; P$85 19.685,-1.905; P$86 18.415,-1.905; P$87 17.145,-1.905; P$88 15.875,-1.905; P$89 14.605,-1.905; P$90 13.335,-1.905; P$91 12.065,-1.905; P$92 10.795,-1.905; P$93 9.525,-1.905; P$94 8.255,-1.905; P$95 6.985,-1.905; P$96 5.715,-1.905; P$97 4.445,-1.905; P$98 3.175,-1.905; P$99 1.905,-1.905; P$100 0.635,-1.905; P$101 -0.635,-1.905; P$102 -1.905,-1.905; P$103 -3.175,-1.905; P$104 -4.445,-1.905; P$105 -5.715,-1.905; P$106 -6.985,-1.905; P$107 -8.255,-1.905; P$108 -9.525,-1.905; P$109 -10.795,-1.905; P$110 -12.065,-1.905; P$111 -13.335,-1.905; P$112 -14.605,-1.905; P$113 -15.875,-1.905; P$114 -17.145,-1.905; P$115 -18.415,-1.905; P$116 -19.685,-1.905; P$117 -20.955,-1.905; P$118 -22.225,-1.905; P$119 -23.495,-1.905; P$120 -24.765,-1.905; P$121 24.765,-3.175; P$122 23.495,-3.175; P$123 22.225,-3.175; P$124 20.955,-3.175; P$125 19.685,-3.175; P$126 18.415,-3.175; P$127 17.145,-3.175; P$128 15.875,-3.175; P$129 14.605,-3.175; P$130 13.335,-3.175; P$131 12.065,-3.175; P$132 10.795,-3.175; P$133 9.525,-3.175; P$134 8.255,-3.175; P$135 6.985,-3.175; P$136 5.715,-3.175; P$137 4.445,-3.175; P$138 3.175,-3.175; P$139 1.905,-3.175; P$140 0.635,-3.175; P$141 -0.635,-3.175; P$142 -1.905,-3.175; P$143 -3.175,-3.175; P$144 -4.445,-3.175; P$145 -5.715,-3.175; P$146 -6.985,-3.175; P$147 -8.255,-3.175; P$148 -9.525,-3.175; P$149 -10.795,-3.175; P$150 -12.065,-3.175; P$151 -13.335,-3.175; P$152 -14.605,-3.175; P$153 -15.875,-3.175; P$154 -17.145,-3.175; P$155 -18.415,-3.175; P$156 -19.685,-3.175; P$157 -20.955,-3.175; P$158 -22.225,-3.175; P$159 -23.495,-3.175; P$160 -24.765,-3.175 | hole 1.321: 27.165,0; -27.191,3.048
PJ-102AH = drill 1.4 long: 1 0,-3; 2 0,3; 3 -4.7,0
JP2 = drill 0.914 long: 1 -2.54,0; 2 0,0; 3 2.54,0
P5-25-13 = drill 1.321 pad 1.905 long: TP-1 -5.08,0; TP-2 -2.54,0; TP-3 0,0; TP-4 2.54,0; TP-5 5.08,0
SOT-23-6 = smd 1 x 0.55: 1 -1.35,0.95; 2 -1.35,0; 3 -1.35,-0.95; 4 1.35,-0.95; 5 1.35,0; 6 1.35,0.95
SOT-23-5 = smd 0.55 x 1: 1 -0.95,-1.35; 2 0,-1.35; 3 0.95,-1.35; 4 0.95,1.35; 5 -0.95,1.35
SOIC127P500X400-8N = smd 1.778 x 0.635: 1 -2.819,1.905; 2 -2.819,0.635; 3 -2.819,-0.635; 4 -2.819,-1.905; 5 2.819,-1.905; 6 2.819,-0.635; 7 2.819,0.635; 8 2.794,1.905
PDS1 = drill 1 octagon: P1 -5.08,0; P2 -2.54,0; P3 0,0; P4 2.54,0

### Placement (x,y rotation side)
A  31.88,4.06 180 top
A_ISOLATED  99.82,56.52 270 top
B  33.27,64.77 0 top
C1  100.2,31.24 90 top
C2  96.52,27.56 180 top
C3  89.28,29.97 270 top
C4  93.85,28.7 270 top
C5  93.6,17.78 90 top
C6  82.93,59.94 0 top
C7  81.66,51.05 0 top
C8  84.33,43.05 0 top
C9  96.39,34.8 0 top
C10  78.61,29.84 90 top
C10_DIR  4.57,8.13 0 top
C11  80.77,13.46 0 top
C11_DIR  4.57,21.59 0 top
C12  78.74,58.42 0 top
C13  77.72,33.53 90 top
C14  64.64,44.7 90 top
C14_DIR  4.57,35.31 0 top
C15  64.64,48.9 270 top
C15_DIR  4.57,49.28 0 top
C16  53.85,13.46 180 top
C18  63.75,14.99 270 top
C18_DIR  4.57,61.72 0 top
C19  57.15,17.27 270 top
C21  59.31,52.32 180 top
C22  59.31,42.16 180 top
C23  59.31,50.16 180 top
C25  54.61,21.59 0 top
C26  50.8,16.76 270 top
D1  96.52,22.1 270 top
D2  100.84,16.76 0 top
D3  58.17,23.37 270 top
DI_ISO  72.39,52.07 90 top
DO_ISO  70.48,40.64 270 top
FMC  18.41,34.93 270 top
G22_ISO  99.06,4.83 0 top
H21_ISO  88.9,4.83 0 top
H22_ISO  78.74,4.83 0 top
J1  97.54,41.53 270 top
J2  57.15,8.89 180 top
L1  74.17,21.08 0 top
LINK-5V  71.37,30.61 270 top
LINK_GNDS  70.99,25.15 180 top
R1  96.52,20.32 180 top
R2  100.08,13.97 0 top
R3  98.04,60.33 180 top
R4  94.61,56.52 90 top
R5  96.52,25.78 0 top
R6  96.52,24 0 top
R7  82.04,33.78 90 top
R8  54.61,19.81 180 top
R9  57.4,20.83 270 top
R10  51.69,44.2 0 top
R11  51.69,45.97 0 top
R12  54.61,23.37 0 top
R14  20.83,34.29 0 top
R15  20.83,33.02 0 top
R16  20.83,30.48 0 top
R17  20.83,29.21 0 top
R18  20.83,26.67 0 top
R19  20.83,25.4 0 top
R20  20.83,22.86 0 top
R21  20.83,21.59 0 top
R22  20.83,19.05 0 top
R23  20.83,17.78 0 top
TP1  79.38,66.93 0 top
TP2  62.87,67.18 180 top
TP3  83.69,22.86 180 top
TP4  44.58,3.43 0 top
TP5  19.81,73.66 315 top
U1  96.52,30.99 270 top
U2  96.77,16.51 180 top
U3  83.82,46.99 0 top
U4  83.31,38.48 0 top
U5  84.07,54.99 180 top
U6  72.9,13.21 0 top
U7  54.36,16.76 90 top
U9  57.4,38.48 0 top
U10  57.4,46.48 0 top
U11  57.4,56.01 180 top
U$1  12.7,44.96 0 top
U$16  [INTAN_LOGO]  0.76,-24.51 0 top  (outside the outline)

### Tracks (layer width: path | path; a pad name or v marks a point on that pad's centre or on a via)
12V_FPGA  (2 unrouted)
  Bottom 0.61: FMC.P$155 12.95,53.34 12.95,55.88 | 12.95,55.88 FMC.P$157 | 12.95,55.88 11.68,57.15 11.68,68.33 -0.25,68.33 -0.25,-0.25 40.39,-0.25
+3V3  (via drill 0.3, 0.5)
  Top 0.254: v65.66,55.88 DI_ISO.P10
  Top 0.406: v61.21,52.32 C21.1 60.17,54.05 U11.1 | v61.21,50.16 C23.1 60.17,48.41 U10.8 | v61.21,42.16 C22.1 60.2,42.14 U9.8 | DI_ISO.P16 64.87,48.26 C15.2 v64.64,46.86 C14.2 65.51,44.7 DO_ISO.P1
  Bottom 0.254: 41.91,3.56 TP4.TP-2
  Bottom 0.406: v17.53,57.15 FMC.P$118 | FMC.P$159 v14.22,58.42 | FMC.P$120 v17.53,59.69 | FMC.P$116 v17.53,54.61
  pour $VCC: 69.85,74.93 -11.43,74.93 -11.43,-5.08 69.85,-5.08
+3V3_ISO  (via drill 0.3)  (2 unrouted)
  Top 0.254: 76.45,44.67 DI_ISO.P1 77.22,48.01 78.23,49.02 80.26,49.02 80.52,48.77 | U4.1 82.8,40.26 | 82.8,40.26 82.93,40.26 83.31,40.64 83.31,42.9 C8.1 83.31,43.2 83.31,47.75 82.3,48.77 U3.1 80.8,49 C7.1 81.16,51.42 80.77,51.8 80.77,52.58 U5.8 81.29,53.34 | DO_ISO.P10 77.22,36.83 | 77.22,36.83 78.61,35.43 | 78.61,35.43 80.26,33.78 86.36,33.78 v87.12,33.02 88.9,33.02 89.15,32.77 89.15,31.75 C3.1 | 77.22,36.83 78.23,36.83 v78.74,37.34 | v83.57,38.86 83.57,39.5 82.8,40.26 | 81.29,53.34 82.55,53.34 83.06,53.85 83.06,57.91 82.07,58.9 C6.1 80.77,59.94 79.6,58.78 C12.2 | 81.29,53.34 U5.8 | C13.2 77.72,34.54 78.61,35.43 | R2.1 99.31,14.07 99.31,14.99 99.14,15.16 U2.5 97.72,13.9 96.77,12.95 87.38,12.95 v83.57,16.76
  Bottom 0.254: v78.74,37.34 82.04,37.34 v83.57,38.86 | v87.12,33.02 83.69,29.59 TP3.TP-3 83.57,22.73 v83.57,16.76
  pour $VCC (rank 2): 72.39,74.93 110.49,74.93 110.49,-5.08 72.39,-5.08
+3V6  (3 unrouted)
  Top 0.254: 53.34,19.05 53.75,19.46 R8.2 C25.1 R12.1 | 53.34,19.05 53.34,18.18 U7.6 | C26.1 51.69,18.92 52.58,19.05 53.34,19.05
+3V6_ISO  (via drill 0.3)
  Top 0.254: A_ISOLATED.B6 98.81,58.17 102.11,58.17 102.87,57.4 102.87,47.75 97.54,42.42 97.54,40.39 102.11,35.81 102.11,31.5 C1.1 100.16,29.64 U1.6 97.38,29.55 C2.1 R5.2 97.51,25.65 98.3,25.65 98.55,25.4 98.55,21.08 | R1.1 97.79,20.32 98.55,21.08 | v99.06,20.07 99.06,20.57 98.55,21.08
  Bottom 0.254: TP3.TP-2 86.23,21.46 87.63,20.07 v99.06,20.07
+5V0_EXT  (via drill 0.3)
  Top 0.254: L1.1 73.3,19.2 v73.15,19.05 | v86.61,29.97 72.14,29.97 71.88,30.23 71.75,30.23 LINK-5V.2
  Bottom 0.254: v73.15,19.05 73.15,22.61 72.14,23.62 72.14,26.16 73.41,27.43 73.41,29.72 72.64,30.48 71.5,30.48 LINK-5V.2 | J1.1 94.54,37.89 v86.61,29.97
+5V0_ISO  (via drill 0.3)
  Top 0.254: 95.57,33.53 U1.3 95.33,32.34 95.25,32.26 93.22,32.26 90.17,35.31 v84.07,35.31 | 95.57,33.53 95.57,34.58 C9.1 | U1.1 97.47,33.09 97.28,33.27 95.82,33.27 95.57,33.53 | v80.47,28.8 C10.1 | U2.1 97.79,17.79 97.79,17.02 97.54,16.76 96.27,16.76 95.82,17.21 U2.3 95.74,17.78 85.6,17.78 83.82,19.56 82.3,19.56 81.28,20.57 81.03,20.57 | TP3.TP-4 81.15,20.7 81.03,20.57 | 76.3,19.81 80.26,19.81 81.03,20.57 | 76.3,19.81 L1.2 75.03,20.98 76.2,19.81 76.3,19.81
  Bottom 0.254: v84.07,35.31 84.07,32.4 v80.47,28.8 81.15,28.12 TP3.TP-4
+5V0_ISO-PRE
  Top 0.254: LINK-5V.3 71.5,28.07 72.14,27.43 72.14,16.76 U6.P4 78.87,13.21 C11.1
A_CS+  (via drill 0.3)
  Top 0.254: R15.1 18.67,33.02 18.41,33.27 11.94,33.27 10.67,32 10.67,10.67 11.94,9.4 28.35,9.4 v30.29,7.46 | v29.59,5.08 A.B1
  Bottom 0.254: v30.29,7.46 30.23,7.4 30.23,5.72 v29.59,5.08
A_CS-
  Top 0.254: R14.1 18.92,34.29 18.41,33.78 11.43,33.78 10.16,32.51 10.16,10.16 11.43,8.89 27.62,8.89 A.T1
A_MISO1+  (via drill 0.3)
  Top 0.254: A.B4 32.26,5.02 v32.26,3.81 | R21.1 19.84,21.46 19.18,21.46 18.29,22.35 16.76,22.35 15.49,21.08 15.49,16.26 16.76,14.99 28.57,14.99 v32.13,11.43
  Bottom 0.254: 32.26,8.64 v32.26,3.81 32.26,11.3 v32.13,11.43
A_MISO1-
  Top 0.254: R20.1 16.25,22.84 14.99,21.57 14.99,15.75 16.26,14.48 27.94,14.48 32.26,10.16 32.26,6.29 A.T4
A_MISO2+  (via drill 0.3)
  Top 0.254: R23.1 19.18,17.78 18.41,18.54 17.4,18.54 16.76,17.91 16.76,17.27 18.03,16 29.59,16 v32.77,12.83 | v32.89,2.67 32.83,2.86 A.B5
  Bottom 0.254: v32.77,12.83 32.89,12.7 v32.89,2.67
A_MISO2-
  Top 0.254: R22.1 16.89,19.05 16.26,18.41 16.26,16.76 17.53,15.49 28.96,15.49 33.08,11.37 33.08,7.68 32.83,7.43 A.T5
A_MOSI+  (via drill 0.3)
  Top 0.254: R19.1 18.8,25.4 18.03,26.16 14.1,26.16 13.46,25.53 13.46,13.72 14.73,12.45 29.16,12.45 v31.5,9.99 | A.B3 31.5,5.02 v31.5,2.67
  Bottom 0.254: v31.5,9.99 31.75,9.73 31.75,6.22 31.5,5.97 v31.5,2.67
A_MOSI-
  Top 0.254: R18.1 13.59,26.67 12.95,26.04 12.95,13.21 14.22,11.94 28.7,11.94 31.69,8.95 31.69,7.81 31.56,7.68 A.T3 | 31.5,6.29 A.T3 | 31.62,6.22 A.T3
A_SCLK+  (via drill 0.3)
  Top 0.254: R17.1 19.05,29.21 18.29,29.97 13.34,29.97 12.07,28.7 12.07,12.57 13.34,11.3 28.44,11.3 v30.99,8.76 | v30.73,3.81 30.93,4 A.B2
  Bottom 0.254: v30.99,8.76 30.99,4.06 v30.73,3.81
A_SCLK-
  Top 0.254: R16.1 12.83,30.48 11.56,29.21 11.56,12.07 12.83,10.8 28.04,10.8 30.93,7.91 A.T2
B_CS+  (via drill 0.3)  (1 unrouted)
  Top 0.254: v35.56,63.75 B.B1
  Bottom 0.254: FMC.P$37 22.86,55.88 24.13,57.15 24.13,67.56 25.4,68.83 35.24,68.83 35.56,68.52 v35.56,63.75
B_CS-  (via drill 0.3)
  Top 0.254: v35.56,62.74 35.56,62.61 B.T1
  Bottom 0.254: FMC.P$38 22.71,57.15 23.62,58.07 23.62,68.07 24.89,69.34 36,69.34 36.32,69.02 36.32,63.06 36,62.74 v35.56,62.74
B_MISO1+  (via drill 0.3)  (1 unrouted)
  Top 0.254: v32,65.79 32.64,65.79 32.96,65.47 B.B4
  Bottom 0.254: FMC.P$28 22.4,44.45 27.18,49.23 27.18,64.52 28.45,65.79 v32,65.79
B_MISO1-  (via drill 0.3)
  Top 0.254: v33.02,60.2 33.02,62.55 B.T4
  Bottom 0.254: FMC.P$29 22.35,45.72 26.67,50.04 26.67,65.02 27.94,66.29 32.7,66.29 33.02,65.98 v33.02,60.2
B_MISO2+  (via drill 0.3)  (1 unrouted)
  Top 0.254: v31.24,64.77 32,64.77 32.32,64.45 B.B5
  Bottom 0.254: FMC.P$25 22.61,40.64 28.19,46.23 28.19,63.5 29.46,64.77 v31.24,64.77
B_MISO2-  (via drill 0.3)
  Top 0.254: v32.26,61.47 32.26,62.55 B.T5
  Bottom 0.254: FMC.P$26 22.29,41.91 27.69,47.31 27.69,64.01 28.96,65.28 31.94,65.28 32.26,64.96 v32.26,61.47
B_MOSI+  (via drill 0.3)  (1 unrouted)
  Top 0.254: v32.77,66.8 33.27,66.8 33.59,66.48 B.B3
  Bottom 0.254: FMC.P$31 22.79,48.26 26.16,51.63 26.16,65.53 27.43,66.8 v32.77,66.8
B_MOSI-  (via drill 0.3)
  Top 0.254: 33.53,63.56 B.T3 33.53,62.55 v33.53,61.47
  Bottom 0.254: FMC.P$32 22.86,49.53 25.65,52.32 25.65,66.04 26.92,67.31 33.21,67.31 33.53,66.99 v33.53,61.47
B_SCLK+  (via drill 0.3)  (1 unrouted)
  Top 0.254: v33.53,67.82 33.91,67.82 34.23,67.5 B.B2
  Bottom 0.254: FMC.P$34 22.6,52.07 25.15,54.62 25.15,66.55 26.42,67.82 v33.53,67.82
B_SCLK-  (via drill 0.3)
  Top 0.254: v34.54,60.2 34.54,60.71 34.29,60.96 34.29,62.55 B.T2
  Bottom 0.254: FMC.P$35 22.65,53.34 24.64,55.32 24.64,67.06 25.91,68.33 34.23,68.33 34.54,68.01 v34.54,60.2
CS+  (via drill 0.3)  (2 unrouted)
  Top 0.254: U10.2 48.13,47.12 v35.81,34.8
  Bottom 0.254: v35.81,34.8 33.53,34.8 31.75,36.58 28.7,36.58 25.15,33.02 22.61,33.02
CS+_ISOLATED
  Top 0.254: A_ISOLATED.B1 98.81,51.82 87.63,40.64 87.63,39.37 87.38,39.12 U4.7
CS-  (via drill 0.3)
  Top 0.254: v22.61,34.29 R14.2 | U10.1 48.39,48.39 v36.32,36.32
  Bottom 0.254: FMC.P$20 v22.61,34.29 25.15,34.29 28.45,37.59 32,37.59 33.27,36.32 v36.32,36.32
CS-_ISOLATED
  Top 0.254: A_ISOLATED.T1 97.66,51.69 86.36,40.39 U4.8
CS_ISOLATED_SE  (via drill 0.3)
  Top 0.254: U4.2 79.38,38.99 78.99,39.37 v78.99,41.4 | v74.42,40.64 DO_ISO.P13
  Bottom 0.254: v78.99,41.4 78.23,40.64 v74.42,40.64
CS_SE
  Top 0.254: U10.7 61.72,47.12 62.48,46.36 62.48,42.42 64.01,40.89 DO_ISO.P4
GND  (via drill 0.3, 0.5)  (5 unrouted)
  Top 0.254: 58.93,19.81 58.93,23.27 D3.C v60.45,23.37 | 58.93,19.81 58.78,19.96 R9.2 | 58.93,19.81 58.93,17.27 58.17,16.51 57.25,16.51 C19.2 57.05,16.51 54.36,16.51 | 54.36,16.51 U7.2 | C26.2 52.45,13.46 52.58,13.46 | C16.2 52.58,13.46 | 52.58,13.46 50.8,15.24 52.07,16.51 54.36,16.51 | v49.78,45.97 R11.1 | v49.78,44.2 R10.1 | DI_ISO.P9 v65.66,57.15 | DO_ISO.P8 v65.4,35.81
  Top 0.305: v30.73,62.61 B.T6 | A.T6 v34.29,6.22
  Top 0.406: v64.64,50.8 C15.1 64.87,49.53 DI_ISO.P15 | v57.4,52.32 C21.2 | v57.4,50.16 C23.2 | v64.64,43.05 C14.1 64.67,43.81 65.4,43.81 65.79,43.43 DO_ISO.P2 | v58.55,44.58 U10.5 | v58.55,36.58 U9.5 | v57.4,42.16 C22.2 | v58.55,57.91 U11.4
  $GND 0.305: v22.61,54.61 23.37,54.61 | v22.61,58.42 23.88,58.93 | v22.86,50.8 23.62,50.55 23.88,50.8 | v14.22,54.61 v14.22,57.15 | v22.86,39.37 24.38,37.85
  Bottom 0.254: FMC.P$36 v22.61,54.61 | FMC.P$39 v22.61,58.42 | FMC.P$33 v22.86,50.8 | v14.22,57.15 FMC.P$158 | FMC.P$156 v14.22,54.61 | FMC.P$24 v22.86,39.37 | FMC.P$27 v22.61,43.18 | FMC.P$30 v22.61,46.99 | v14.22,50.8 FMC.P$153 | FMC.P$152 v14.22,49.53 | FMC.P$117 v17.53,55.88 | FMC.P$119 v17.53,58.42 | v14.22,59.69 FMC.P$160 | v14.22,34.29 FMC.P$140 | v14.22,35.56 FMC.P$141 | v17.53,36.83 FMC.P$102 | v19.3,38.1 FMC.P$63 | v17.53,40.64 FMC.P$105 | v19.3,41.91 FMC.P$66 | v17.53,44.45 FMC.P$108 | v19.3,45.72 FMC.P$69 | v19.3,49.53 FMC.P$72 | v19.3,53.34 FMC.P$75 | v19.3,57.15 FMC.P$78 | v19.3,59.69 FMC.P$80 | v14.48,31.12 FMC.P$137 | v17.53,29.21 FMC.P$96 | FMC.P$136 v14.22,29.21 | v14.22,25.4 FMC.P$133 | v14.22,24.13 FMC.P$132 | FMC.P$93 v17.53,25.4 | FMC.P$90 v17.53,21.59 | FMC.P$129 v14.22,20.32 | FMC.P$128 v14.22,19.05 | v17.53,17.78 FMC.P$87 FMC.P$86 | v19.3,13.97 FMC.P$44 FMC.P$45 | v17.14,13.21 FMC.P$83 FMC.P$82 | v14.22,10.16 FMC.P$121 | v14.22,13.97 FMC.P$124 | v14.22,15.24 FMC.P$125 | v14.22,44.45 FMC.P$148 | FMC.P$149 v14.22,45.72 | v14.22,39.37 FMC.P$144 | v14.22,40.64 FMC.P$145 | v22.61,24.13 FMC.P$12 | v19.3,23.88 FMC.P$51 | v19.3,27.69 FMC.P$54 | v19.3,31.5 FMC.P$57 | v19.3,20.07 FMC.P$48 | FMC.P$6 v22.61,16.51 | v19.3,10.16 FMC.P$41 | FMC.P$3 v22.23,13.34 | FMC.P$21 v22.61,35.56 | FMC.P$60 v19.3,35.31
  other vias: 22.61,20.32 22.61,31.75 22.61,27.94
  pour $GND: -10.16,73.66 69.85,73.66 69.85,-3.81 -10.16,-3.81
GND_ISO  (via drill 0.3)  (1 unrouted)
  Top 0.254: TP1.TP-1 74.29,65.66 76.45,63.5 v76.45,58.93 | v80.26,35.31 U4.4 | A_ISOLATED.T6 97.66,58.8 97.79,58.93 100.33,58.93 v100.58,59.18 | v100.58,61.72 100.58,62.74 100.33,62.99 | U5.5 81.16,58.03 v81.03,58.17 | v76.45,58.93 DI_ISO.P8 | DO_ISO.P15 75.44,43.18 74.68,43.94 v74.68,44.45 | C3.2 90.3,28.32 v91.19,29.21 | v92.2,26.67 93.73,26.67 93.98,26.92 93.98,27.71 C4.2 | v97.54,36.58 97.54,34.9 C9.2 99.06,34.8 100.2,33.66 C1.2 99.06,31.24 97.03,31.24 96.52,31.75 U1.2 | U3.4 81.03,44.7 v82.04,43.69 | C7.2 v84.07,51.05 | DI_ISO.P2 v75.18,49.28 | C8.2 86.49,43.05 v86.61,43.18 | C6.2 83.79,60.48 v83.06,61.21 | C12.1 77.32,58.06 v76.45,58.93 | 78.61,31.77 C10.2 76.56,30.89 76.45,30.99 76.23,31.21 DO_ISO.P9 | 78.61,31.77 C13.1 | R6.2 D1.C 97.38,21.95 96.52,21.08 96.52,19.05 | 96.52,19.05 96.77,18.8 | U2.2 96.77,18.8 | 96.77,18.8 100.33,18.8 100.84,18.29 D2.C | 78.61,31.77 78.84,32 v80.26,32 81.79,32 82.04,32.26 R7.1 | C11.2 v84.33,13.46 | C5.2 94.84,18.64 95.25,19.05 96.52,19.05
  $GND 0.305: v74.68,44.45 74.93,44.7 74.93,45.47 | v84.07,51.05 84.07,51.31 | v75.18,49.28 74.93,49.02 | v86.61,43.18 86.87,43.43 | v83.06,61.21 82.8,61.21
  $GND 0.406: v84.33,13.46 84.84,13.46 | U6.P3 74.93,11.18 74.93,8.64 H22_ISO.GND$1 | v80.26,32 v80.26,35.31
  Bottom 0.254: 76.71,58.17 v76.45,58.93 | LINK_GNDS.2 70.99,23.5 71.88,22.61 71.88,14.22 U6.P3
  pour $GND (rank 2): 72.39,73.66 109.22,73.66 109.22,-3.81 72.39,-3.81
MISO1+  (via drill 0.3)  (1 unrouted)
  Top 0.254: R21.2 v22.61,21.59 | v25.78,30.73 29.59,34.54 31.24,34.54 53.34,56.64 U11.6
  Bottom 0.254: FMC.P$10 v22.61,21.59 25.78,24.77 v25.78,30.73
MISO1+_ISOLATED  (via drill 0.3)
  Top 0.254: 88.9,55.75 94.51,55.75 R4.1 94.61,54.23 v94.74,54.1 | A_ISOLATED.B4 100.9,56.83 v101.85,55.88 | v88.9,56.64 88.9,55.75 | 88.9,55.75 88.77,55.63 U5.3
  Bottom 0.254: v94.74,54.1 100.08,54.1 v101.85,55.88 | TP1.TP-4 81.91,65.91 88.9,58.93 v88.9,56.64
MISO1-  (via drill 0.3)
  Top 0.254: R20.2 v22.61,22.86 | v24.64,30.73 29.46,35.56 30.99,35.56 53.34,57.91 U11.5
  Bottom 0.254: FMC.P$11 v22.61,22.86 24.64,24.89 v24.64,30.73
MISO1-_ISOLATED
  Top 0.254: U5.4 87.5,57.02 88.14,57.66 94.08,57.66 R4.2 95.16,56.83 A_ISOLATED.T4
MISO1_ISOLATED_SE
  Top 0.254: DI_ISO.P4 76.96,51.82 77.98,52.83 77.98,54.61 78.99,55.63 | 78.99,55.63 U5.6 | TP1.TP-5 84.45,64.13 81.53,61.21 80.26,61.21 78.74,59.69 78.74,55.88 78.99,55.63
MISO1_SE  (1 unrouted)
  Top 0.254: DI_ISO.P13 65.91,52.07 61.34,56.64 U11.3
MISO2+  (via drill 0.3)
  Top 0.254: R23.2 v22.61,17.78 | v31.24,33.53 53.09,55.37 U11.7
  Bottom 0.254: FMC.P$7 v22.61,17.78 24.13,17.78 31.24,24.89 v31.24,33.53
MISO2+_ISOLATED  (via drill 0.3)
  Top 0.254: v101.85,57.15 101.28,57.47 A_ISOLATED.B5 98.81,57.4 | v101.85,60.2 99.03,60.2 R3.1 98.81,60.43 98.81,61.72 v95.5,61.72 | U5.2 92.46,54.36 92.58,54.48 92.84,54.48 v92.96,54.61
  Bottom 0.254: v101.85,57.15 v101.85,60.2 | v92.96,54.61 92.96,59.18 v95.5,61.72
MISO2-  (via drill 0.3)  (2 unrouted)
  Top 0.254: v28.7,29.97 29.21,29.97 32.26,33.02 32.26,33.53 52.83,54.1 U11.8
  Bottom 0.254: v28.7,29.97 28.7,25.15 v22.61,19.05
MISO2-_ISOLATED
  Top 0.254: A_ISOLATED.T5 96.96,57.47 95.76,58.67 | R3.2 95.76,58.9 95.76,58.67 | 95.76,58.67 86.36,58.67 85.34,57.66 85.34,53.34 85.6,53.09 U5.1 87.12,53.09
MISO2_ISOLATED_SE
  Top 0.254: DI_ISO.P3 77.22,50.55 78.74,52.07 78.74,53.85 79.25,54.36 U5.7
MISO2_SE
  Top 0.254: U11.2 61.34,55.37 65.91,50.8 DI_ISO.P14
MOSI+  (via drill 0.3)  (1 unrouted)
  Top 0.254: R19.2 v22.61,25.4 22.99,25.4 23.75,26.16 31.75,26.16 41.66,36.07 52.83,36.07 53.21,35.69 55.88,35.69 56.26,36.07 56.26,37.34 55.75,37.85 U9.3
  Bottom 0.254: v22.61,25.4 FMC.P$13
MOSI+_ISOLATED  (via drill 0.3)  (1 unrouted)
  Top 0.254: A_ISOLATED.B3 98.81,56.13 99.82,56.13 100.84,55.12 100.84,50.29 v100.08,49.53 | v90.17,49.53 88.27,47.62 | TP1.TP-2 76.83,65.4 77.98,64.26 81.53,64.26 v82.04,63.75
  Bottom 0.254: v100.08,49.53 v90.17,49.53 87.63,52.07 87.63,58.17 v82.04,63.75
MOSI-  (via drill 0.3)
  Top 0.254: R18.2 v22.61,26.67 31.5,26.67 41.4,36.58 U9.4
  Bottom 0.254: v22.61,26.67 FMC.P$14
MOSI-_ISOLATED  (1 unrouted)
  Top 0.254: A_ISOLATED.T3 96.84,56.2 95.76,55.12 95.76,53.59 92.46,50.29 89.41,50.29 87.88,48.77 87.76,48.9
MOSI_ISOLATED_SE  (via drill 0.3)  (2 unrouted)
  Top 0.254: v74.17,59.69 73.41,58.93 73.41,38.1 73.91,37.59 74.93,37.59 75.44,38.1
  Bottom 0.254: TP1.TP-3 79.38,64.9 v74.17,59.69
MOSI_SE  (1 unrouted)
  Top 0.254: DO_ISO.P6 63.88,38.35 63.25,37.72 60.35,37.72 U9.6
N$1
  Top 0.254: 54.46,45.72 U10.3 52.68,45.85 R11.2
N$3
  Top 0.254: U10.4 54.51,44.5 52.86,44.5 arc90 R10.2
N$4
  Top 0.254: R12.2 D3.A
N$5
  Top 0.254: U4.3 82.04,37.85 R7.2
N$10
  Top 0.254: D2.A 100.84,14.07 R2.2
N$11
  Top 0.254: D1.A R1.2
N$14
  Top 0.254: C19.1 55.33,18.14 U7.4
N$27
  Top 0.254: R9.1 55.58,21.69 C25.2 R8.1 55.37,19.81 54.36,18.8 U7.5
N$36
  Top 0.254: C4.1 95.59,29.62 U1.4
N$37
  Top 0.254: R6.1 R5.1 C2.2 95.66,28.09 96.52,28.96 U1.5
N$97
  Top 0.254: C5.1 93.6,15.88 94.23,15.24 95.74,15.24 U2.4
SCLK+  (via drill 0.3)  (1 unrouted)
  Top 0.254: FMC.P$16 R17.2 v22.61,29.21 23.88,27.94 30.73,27.94 42.67,39.88 53.09,39.88 53.85,39.12 U9.2
SCLK+_ISOLATED  (via drill 0.3)  (1 unrouted)
  Top 0.254: 99.06,55.63 99,55.56 A_ISOLATED.B2 99.38,55.56 100.08,54.86 100.08,51.56 v97.03,48.51 | v91.19,48.51 89.03,46.36
  Bottom 0.254: v97.03,48.51 v91.19,48.51
SCLK-  (via drill 0.3)
  Top 0.254: R16.2 v22.61,30.48 24.64,28.45 30.48,28.45 42.42,40.39 U9.1
  Bottom 0.254: v22.61,30.48 FMC.P$17
SCLK-_ISOLATED  (1 unrouted)
  Top 0.254: A_ISOLATED.T2 96.96,55.56 96.52,55.12 96.52,51.56 90.04,45.09
SCLK_ISOLATED_SE  (via drill 0.3)  (1 unrouted)
  Top 0.254: U3.2 78.74,47.5 77.72,46.48 77.72,38.86 76.96,38.1 | 79.76,46.23 79.25,45.72 79.25,43.69 80.26,42.93 80.77,42.93 81.03,42.67 v81.03,41.91 | DO_ISO.P12 74.93,39.37 v74.42,38.86
  Bottom 0.254: v74.42,38.86 75.18,39.62 79.25,39.62 81.03,41.4 v81.03,41.91
SCLK_SE
  Top 0.254: U9.7 63.5,39.12 64.01,39.62 DO_ISO.P5
TP1_FROM_SMA  (via drill 0.3)
  Top 0.254: DI_ISO.P5 75.69,53.09 v74.68,52.07
  Bottom 0.254: v74.68,52.07 74.68,52.32 72.64,50.29 72.64,37.34 75.69,34.29 75.69,16.76 84.58,7.87 84.58,6.35 86.11,4.83 H21_ISO.CLK
TP1_TO_FPGA  (via drill 0.3)
  Top 0.254: DI_ISO.P12 v65.66,53.34
  Bottom 0.254: FMC.P$22 23.37,36.83 39.69,53.15 39.88,53.34 v65.66,53.34
TP2_FROM_SMA  (via drill 0.3)
  Top 0.254: DI_ISO.P6 75.18,54.36 v74.93,54.1
  Bottom 0.254: v74.93,54.1 71.88,51.05 71.88,37.08 74.93,34.04 74.93,16.51 78.74,12.7 H22_ISO.CLK
TP2_TO_FPGA  (via drill 0.3)
  Top 0.254: DI_ISO.P11 v65.66,54.61
  Bottom 0.254: FMC.P$23 23.62,38.1 39.37,53.85 63.75,53.85 64.52,54.61 v65.66,54.61
TP3_FROM_FPGA  (via drill 0.3)
  Top 0.254: v65.28,42.16 DO_ISO.P3
  Bottom 0.203: FMC.P$62 20.96,36.2 25.53,36.2
  Bottom 0.254: 25.53,36.2 31.5,42.16 54.74,42.16 56.13,40.77 63.88,40.77 v65.28,42.16
TP3_TO_SMA  (via drill 0.3)
  Top 0.254: DO_ISO.P14 74.93,41.91 v74.42,42.42
  Bottom 0.254: v74.42,42.42 73.41,41.4 73.41,37.85 76.45,34.8 76.45,17.27 84.33,9.4 92.46,9.4 94.23,7.62 94.23,6.1 95.5,4.83 G22_ISO.CLK
TP4
  Bottom 0.254: FMC.P$130 13.97,21.59 9.4,17.02 9.4,10.41 7.11,8.13 C10_DIR.CLK
TP5
  Bottom 0.254: FMC.P$131 9.14,22.86 7.87,21.59 C11_DIR.CLK
TP6
  Bottom 0.254: FMC.P$134 9.91,26.67 4.57,32 C14_DIR.CLK
TP7
  Bottom 0.254: FMC.P$135 13.72,27.94 9.4,32.26 9.4,47.24 7.37,49.28 C15_DIR.CLK
TP8
  Bottom 0.254: FMC.P$138 14.22,31.75 10.16,35.81 10.16,58.93 7.37,61.72 C18_DIR.CLK
VDD_IN  (3 unrouted)
  Top 0.254: U7.3 55.37,15.35 55.37,14.73 54.89,14.25 C16.1 54.86,13.46 53.59,14.73 53.59,15.23 U7.1

### Text on the board
tPlace: CLK_N | CLK_N
tNames: b_cs+ | isolated | gnd | mosi+ | mosi_se | gnd | mosi+ | mosi_se | b_sclk+ | miso1+ | miso1+ | miso1_se | A | b_mosi+ | B | isolated | TP8 | b_miso1+ | miso1_se | b_miso2+ | non-isolated | TP7 | FMC prototype board / for | 5V / isolated | TP6 | jack | RHD headstages / rev. 0.1 | fpga12>5V DCDC | gnd | 5v | vdd_is | TP5 | isolated | vdd33 | TP4 | non-isolated | A | 3.6v_hs | 3v_fpga | vdd33 | vdd_in | gnd | 5V non- / isolated | 1_to_fpga | 2_to_fpga | TP | 3_from_fpga